# EAGLE board tfmsx (EAGLE 9.6.2), part 1 of 2
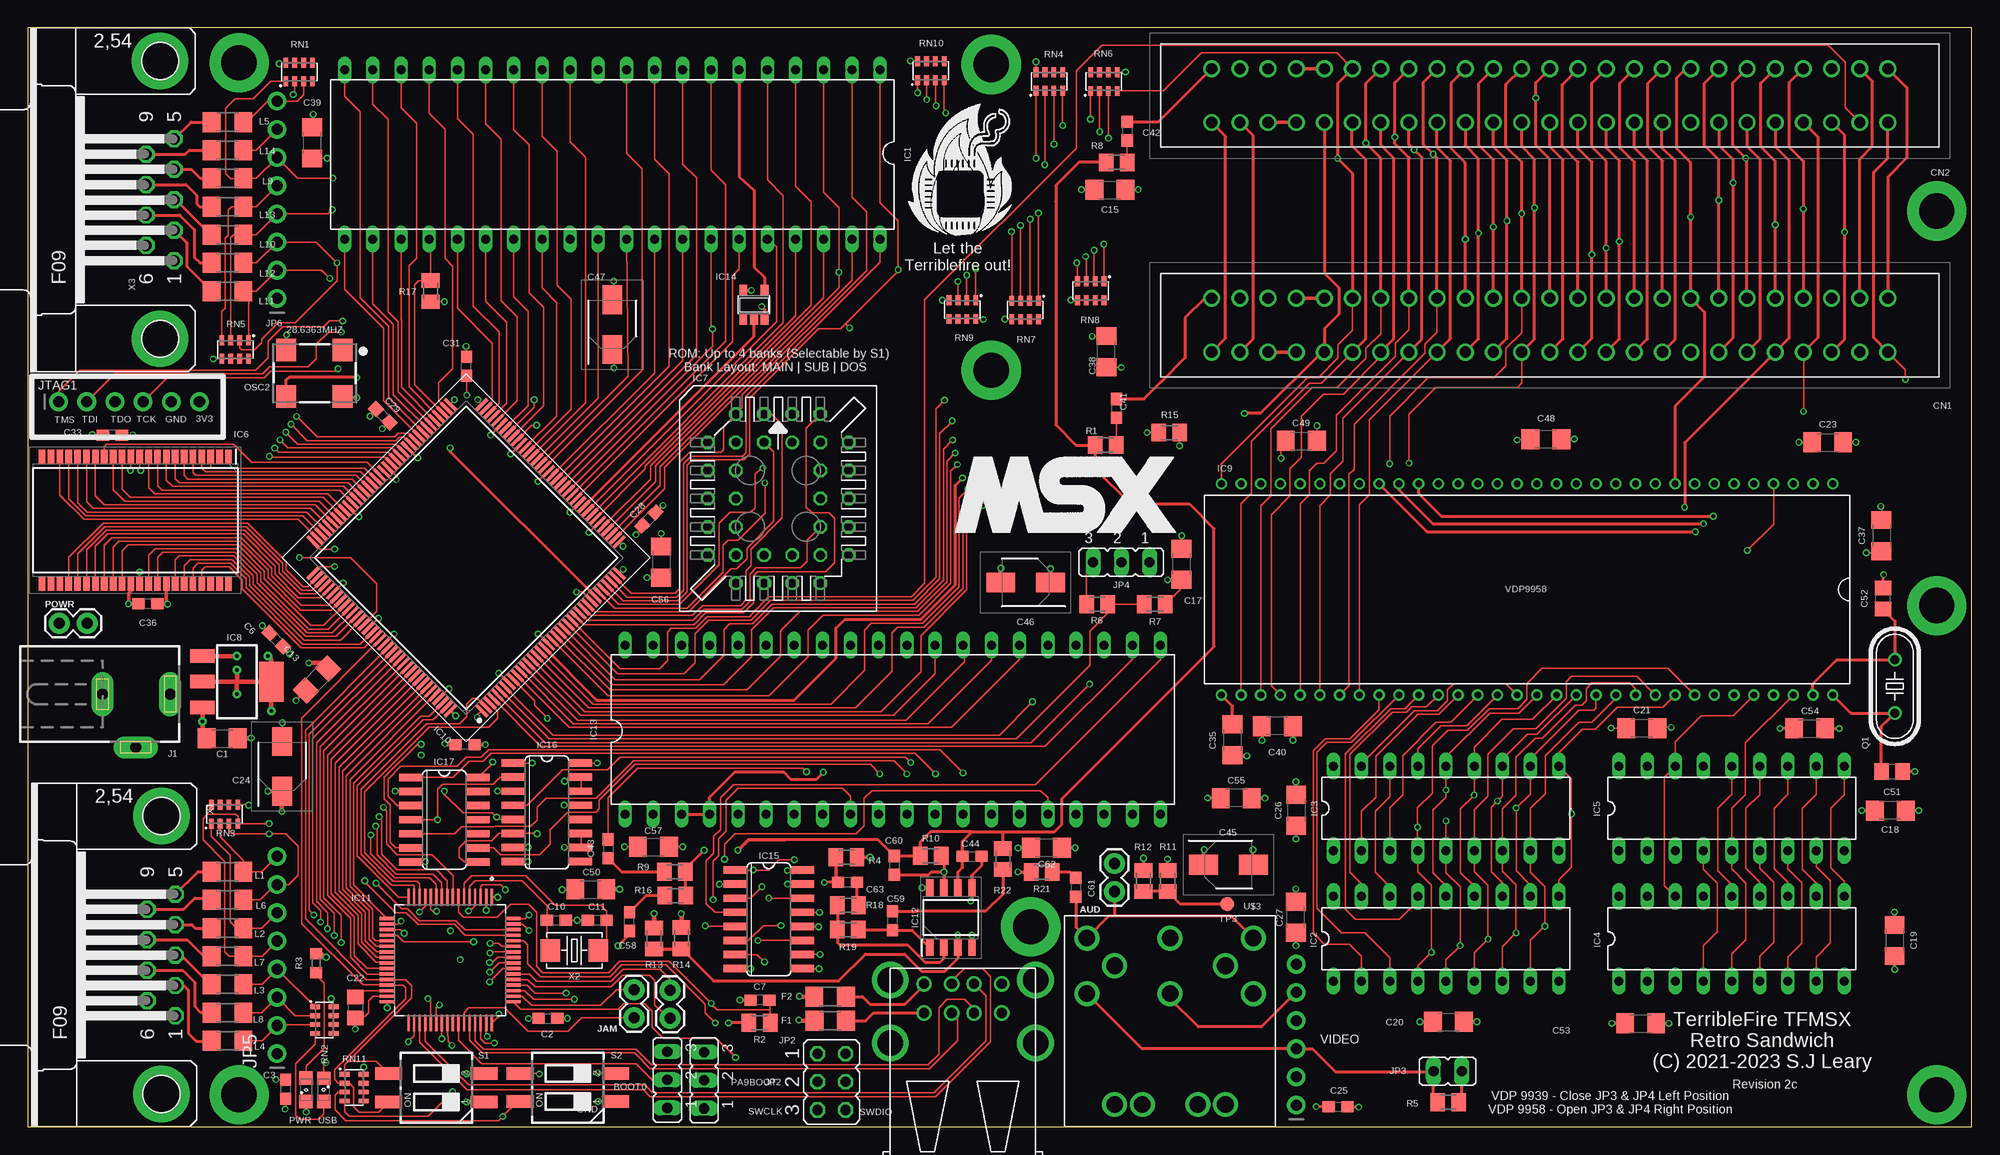
[diagram p3: board, top side]
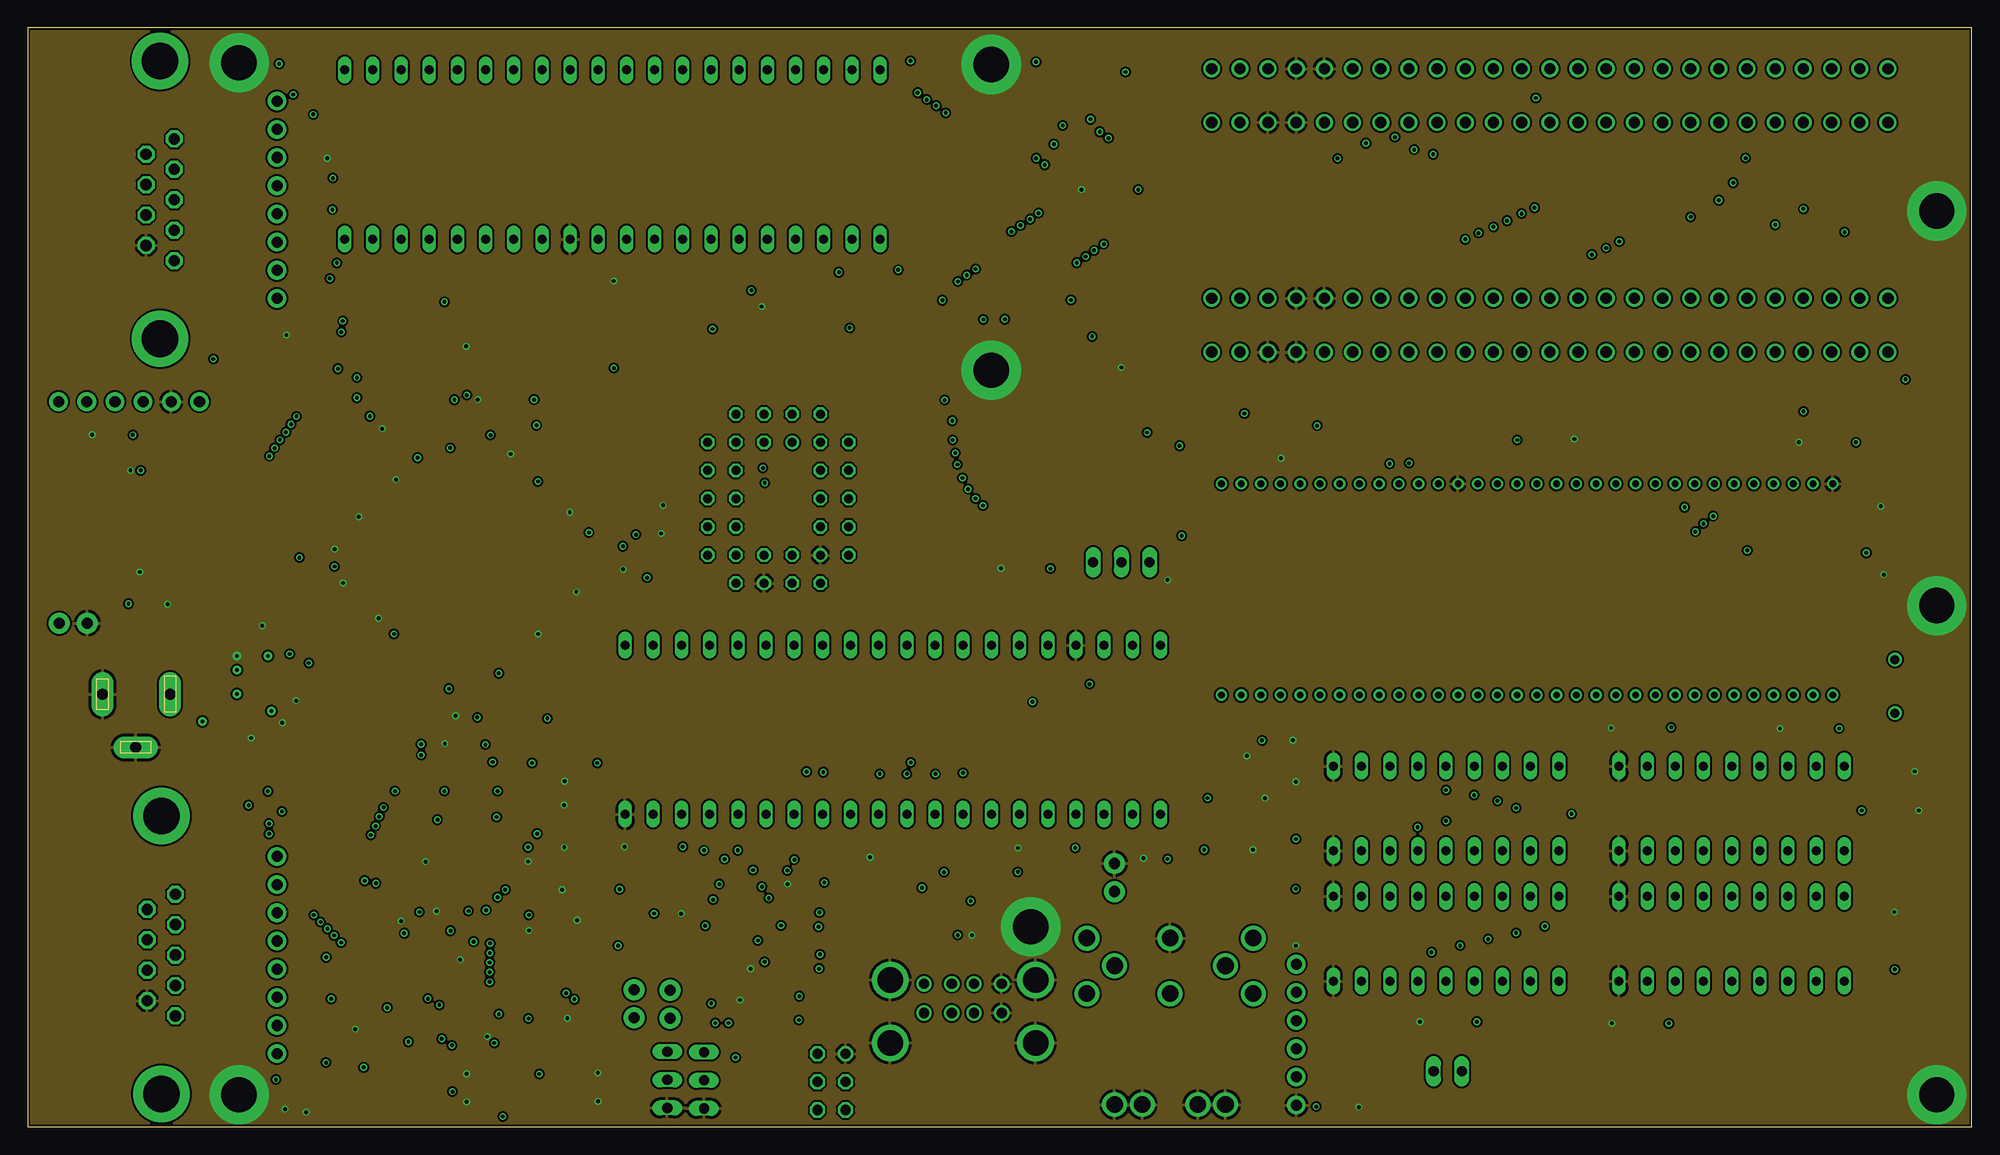
[diagram p4: board, inner layer GND]
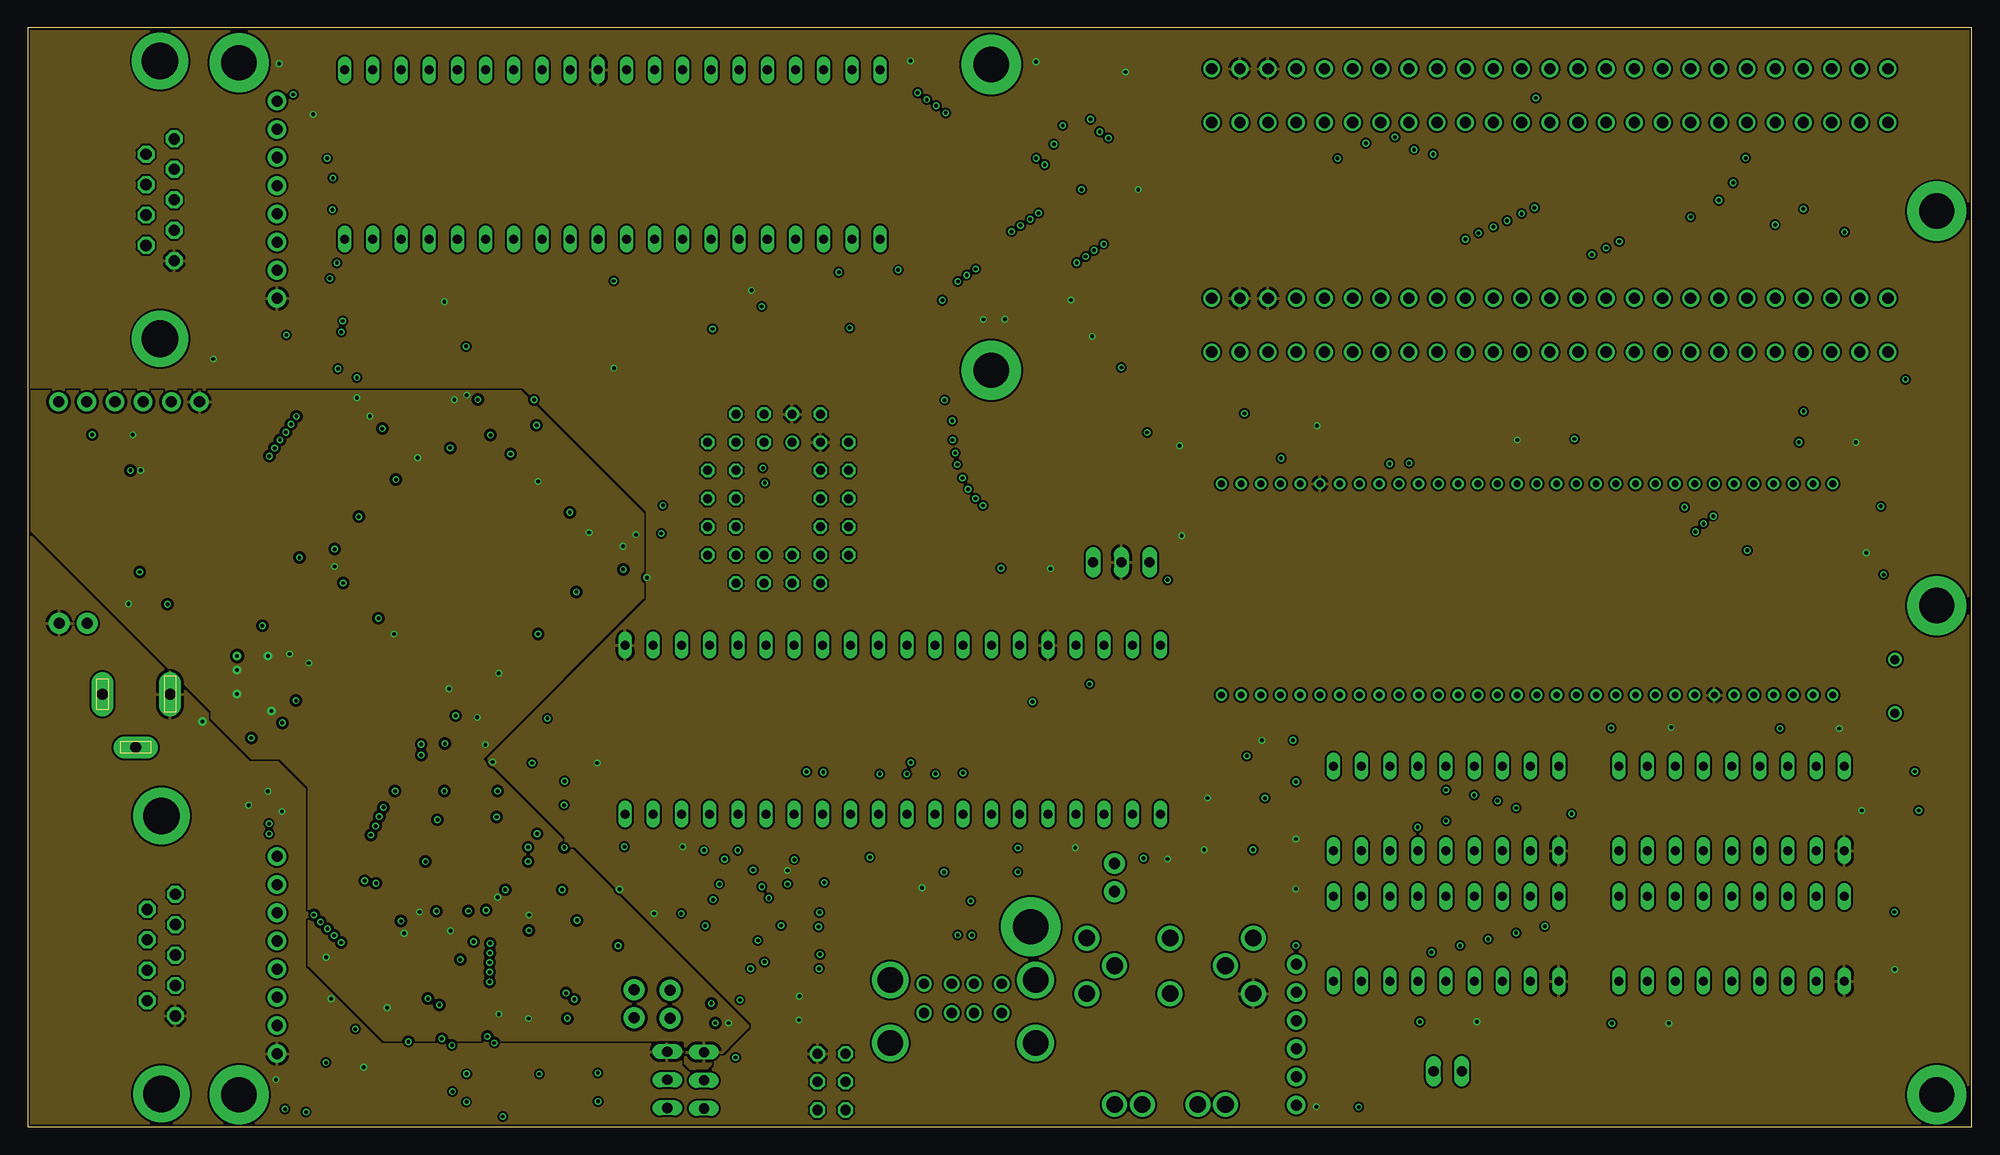
[diagram p5: board, inner layer PWR]
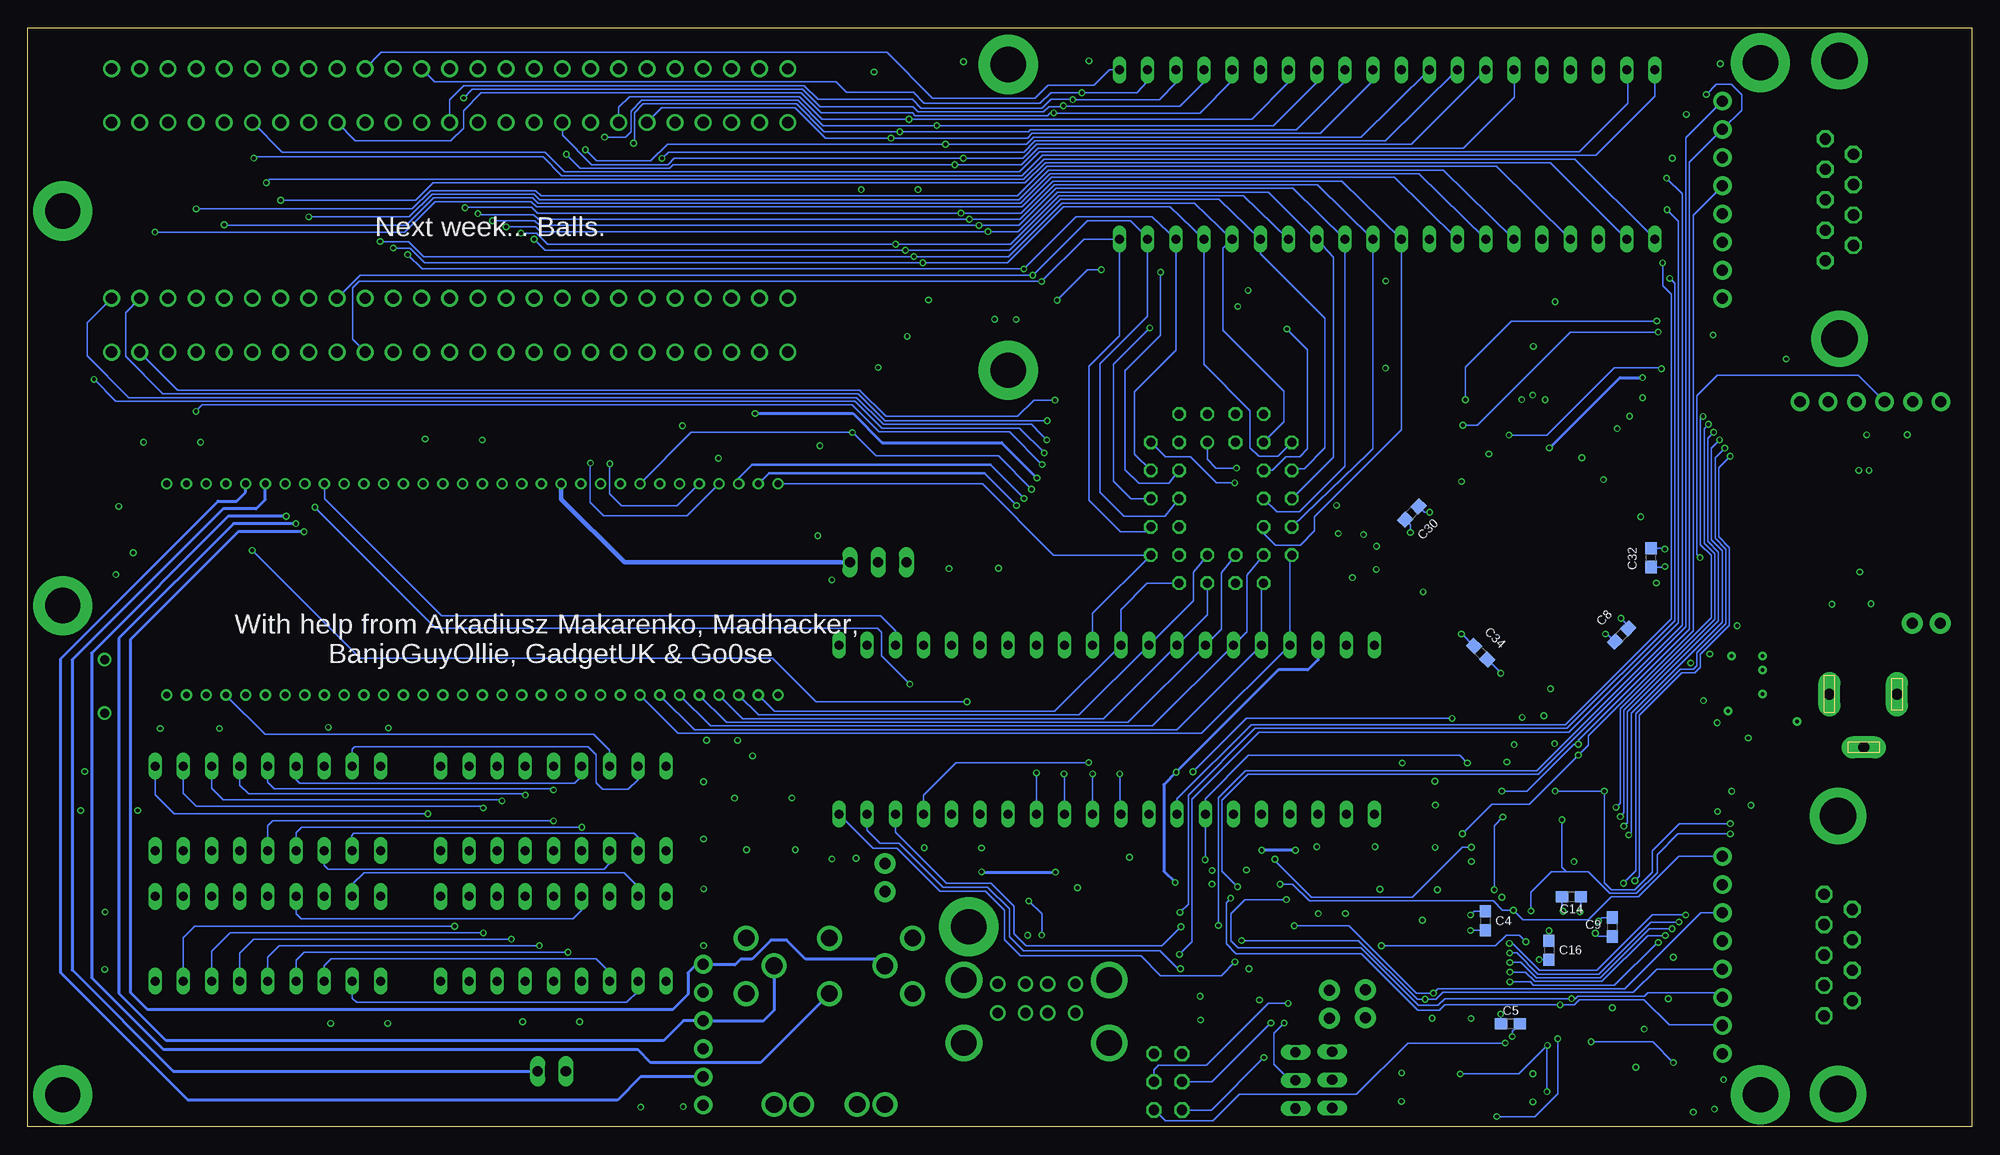
[diagram p6: board, bottom side, seen from below]

Size 175.26 x 99.07 mm. Coordinates in mm from the lower left corner, seen from the top.
Outline: 0,0 175.26,0 175.26,99.07 0,99.07 0,0
Copper layers (1*2*15*16): Top 0.035559375mm / dielectric 1.501140625mm / GND 0.035559375mm / dielectric 0.149859375mm / PWR 0.035559375mm / dielectric 0.200659375mm / Bottom 0.035559375mm
Design rules "jlcpcb-4layer": minimum track width 5mil, minimum drill 0.2mm, track to track 7mil, track to pad 8mil, pad to pad 7mil, via to via 10mil, smd to smd 0mil, copper to edge 0.2mm, drill to drill 10mil, minimum pad ring 3mil, minimum via ring 5mil, stop-mask expansion 3mil, vias tented up to drill 0.2mm, thermal gap 10mil
Net classes: 0 default: width 0.152 mm, drill 0.3 mm, clearance 0.152 mm

## Footprints (pad centres in the part's own frame; a part is rotated, then mirrored left to right if it is on the bottom)
1X02 = drill 1.016 pad 1.88: 1 0,0; 2 2.54,0
JP2 = drill 0.914 long: 1 -2.54,0; 2 0,0; 3 2.54,0
C1206 = smd 1.6 x 1.8: 1 -1.4,0; 2 1.4,0
C0603 = smd 1.1 x 1: 1 -0.85,0; 2 0.85,0
C0805 = smd 1.3 x 1.5: 1 -0.95,0; 2 0.95,0
CAPAE430X550N = smd 2.6 x 1.8: 1 -2.25,0; 2 2.25,0
55308435 = drill 1.016 pad 1.524: 1 0,0; 2 0,4.851; 3 2.54,0; 4 2.54,4.851; 5 5.08,0; 6 5.08,4.851; 7 7.62,0; 8 7.62,4.851; 9 10.16,0; 10 10.16,4.851; 11 12.7,0; 12 12.7,4.851; 13 15.24,0; 14 15.24,4.851; 15 17.78,0; 16 17.78,4.851; 17 20.32,0; 18 20.32,4.851; 19 22.86,0; 20 22.86,4.851; 21 25.4,0; 22 25.4,4.851; 23 27.94,0; 24 27.94,4.851; 25 30.48,0; 26 30.48,4.851; 27 33.02,0; 28 33.02,4.851; 29 35.56,0; 30 35.56,4.851; 31 38.1,0; 32 38.1,4.851; 33 40.64,0; 34 40.64,4.851; 35 43.18,0; 36 43.18,4.851; 37 45.72,0; 38 45.72,4.851; 39 48.26,0; 40 48.26,4.851; 41 50.8,0; 42 50.8,4.851; 43 53.34,0; 44 53.34,4.851; 45 55.88,0; 46 55.88,4.851; 47 58.42,0; 48 58.42,4.851; 49 60.96,0; 50 60.96,4.851
R1206 = smd 1.6 x 1.803: 1 -1.422,0; 2 1.422,0
DIL40 = drill 0.813 long: 1 -24.13,-7.62; 2 -21.59,-7.62; 3 -19.05,-7.62; 4 -16.51,-7.62; 5 -13.97,-7.62; 6 -11.43,-7.62; 7 -8.89,-7.62; 8 -6.35,-7.62; 9 -3.81,-7.62; 10 -1.27,-7.62; 11 1.27,-7.62; 12 3.81,-7.62; 13 6.35,-7.62; 14 8.89,-7.62; 15 11.43,-7.62; 16 13.97,-7.62; 17 16.51,-7.62; 18 19.05,-7.62; 19 21.59,-7.62; 20 24.13,-7.62; 21 24.13,7.62; 22 21.59,7.62; 23 19.05,7.62; 24 16.51,7.62; 25 13.97,7.62; 26 11.43,7.62; 27 8.89,7.62; 28 6.35,7.62; 29 3.81,7.62; 30 1.27,7.62; 31 -1.27,7.62; 32 -3.81,7.62; 33 -6.35,7.62; 34 -8.89,7.62; 35 -11.43,7.62; 36 -13.97,7.62; 37 -16.51,7.62; 38 -19.05,7.62; 39 -21.59,7.62; 40 -24.13,7.62
DIL18 = drill 0.813 long: 1 -10.16,-3.81; 2 -7.62,-3.81; 3 -5.08,-3.81; 4 -2.54,-3.81; 5 0,-3.81; 6 2.54,-3.81; 7 5.08,-3.81; 8 7.62,-3.81; 9 10.16,-3.81; 10 10.16,3.81; 11 7.62,3.81; 12 5.08,3.81; 13 2.54,3.81; 14 0,3.81; 15 -2.54,3.81; 16 -5.08,3.81; 17 -7.62,3.81; 18 -10.16,3.81
SOP80P1181X120-44N = smd 1.295 x 0.6: 1 -5.728,8.4; 2 -5.728,7.6; 3 -5.728,6.8; 4 -5.728,6; 5 -5.728,5.2; 6 -5.728,4.4; 7 -5.728,3.6; 8 -5.728,2.8; 9 -5.728,2; 10 -5.728,1.2; 11 -5.728,0.4; 12 -5.728,-0.4; 13 -5.728,-1.2; 14 -5.728,-2; 15 -5.728,-2.8; 16 -5.728,-3.6; 17 -5.728,-4.4; 18 -5.728,-5.2; 19 -5.728,-6; 20 -5.728,-6.8; 21 -5.728,-7.6; 22 -5.728,-8.4; 23 5.728,-8.4; 24 5.728,-7.6; 25 5.728,-6.8; 26 5.728,-6; 27 5.728,-5.2; 28 5.728,-4.4; 29 5.728,-3.6; 30 5.728,-2.8; 31 5.728,-2; 32 5.728,-1.2; 33 5.728,-0.4; 34 5.728,0.4; 35 5.728,1.2; 36 5.728,2; 37 5.728,2.8; 38 5.728,3.6; 39 5.728,4.4; 40 5.728,5.2; 41 5.728,6; 42 5.728,6.8; 43 5.728,7.6; 44 5.728,8.4
PLCC-S32 = drill 0.813: 1 1.27,5.08 | drill 0.813 octagon: 2 -1.27,7.62; 3 -1.27,5.08; 4 -3.81,7.62; 5 -6.35,5.08; 6 -3.81,5.08; 7 -6.35,2.54; 8 -3.81,2.54; 9 -6.35,0; 10 -3.81,0; 11 -6.35,-2.54; 12 -3.81,-2.54; 13 -6.35,-5.08; 14 -3.81,-7.62; 15 -3.81,-5.08; 16 -1.27,-7.62; 17 -1.27,-5.08; 18 1.27,-7.62; 19 1.27,-5.08; 20 3.81,-7.62; 21 6.35,-5.08; 22 3.81,-5.08; 23 6.35,-2.54; 24 3.81,-2.54; 25 6.35,0; 26 3.81,0; 27 6.35,2.54; 28 3.81,2.54; 29 6.35,5.08; 30 3.81,7.62; 31 3.81,5.08; 32 1.27,7.62
SOT223 = smd 1.219 x 2.235: 1 -2.311,-3.099; 2 0,-3.099; 3 2.311,-3.099 | smd 3.6 x 2.2: TAB 0,3.099
SOT274 = drill 0.61 pad 1.016: 1 -27.559,-9.525; 2 -25.781,-9.525; 3 -24.003,-9.525; 4 -22.225,-9.525; 5 -20.447,-9.525; 6 -18.669,-9.525; 7 -16.891,-9.525; 8 -15.113,-9.525; 9 -13.335,-9.525; 10 -11.557,-9.525; 11 -9.779,-9.525; 12 -8.001,-9.525; 13 -6.223,-9.525; 14 -4.445,-9.525; 15 -2.667,-9.525; 16 -0.889,-9.525; 17 0.889,-9.525; 18 2.667,-9.525; 19 4.445,-9.525; 20 6.223,-9.525; 21 8.001,-9.525; 22 9.779,-9.525; 23 11.557,-9.525; 24 13.335,-9.525; 25 15.113,-9.525; 26 16.891,-9.525; 27 18.669,-9.525; 28 20.447,-9.525; 29 22.225,-9.525; 30 24.003,-9.525; 31 25.781,-9.525; 32 27.559,-9.525; 33 27.559,9.525; 34 25.781,9.525; 35 24.003,9.525; 36 22.225,9.525; 37 20.447,9.525; 38 18.669,9.525; 39 16.891,9.525; 40 15.113,9.525; 41 13.335,9.525; 42 11.557,9.525; 43 9.779,9.525; 44 8.001,9.525; 45 6.223,9.525; 46 4.445,9.525; 47 2.667,9.525; 48 0.889,9.525; 49 -0.889,9.525; 50 -2.667,9.525; 51 -4.445,9.525; 52 -6.223,9.525; 53 -8.001,9.525; 54 -9.779,9.525; 55 -11.557,9.525; 56 -13.335,9.525; 57 -15.113,9.525; 58 -16.891,9.525; 59 -18.669,9.525; 60 -20.447,9.525; 61 -22.225,9.525; 62 -24.003,9.525; 63 -25.781,9.525; 64 -27.559,9.525
SAMACSYS_PARTS_QFP50P2200X2200X160-144N = smd 1.475 x 0.3: 1 -10.738,8.75; 2 -10.738,8.25; 3 -10.738,7.75; 4 -10.738,7.25; 5 -10.738,6.75; 6 -10.738,6.25; 7 -10.738,5.75; 8 -10.738,5.25; 9 -10.738,4.75; 10 -10.738,4.25; 11 -10.738,3.75; 12 -10.738,3.25; 13 -10.738,2.75; 14 -10.738,2.25; 15 -10.738,1.75; 16 -10.738,1.25; 17 -10.738,0.75; 18 -10.738,0.25; 19 -10.738,-0.25; 20 -10.738,-0.75; 21 -10.738,-1.25; 22 -10.738,-1.75; 23 -10.738,-2.25; 24 -10.738,-2.75; 25 -10.738,-3.25; 26 -10.738,-3.75; 27 -10.738,-4.25; 28 -10.738,-4.75; 29 -10.738,-5.25; 30 -10.738,-5.75; 31 -10.738,-6.25; 32 -10.738,-6.75; 33 -10.738,-7.25; 34 -10.738,-7.75; 35 -10.738,-8.25; 36 -10.738,-8.75; 73 10.738,-8.75; 74 10.738,-8.25; 75 10.738,-7.75; 76 10.738,-7.25; 77 10.738,-6.75; 78 10.738,-6.25; 79 10.738,-5.75; 80 10.738,-5.25; 81 10.738,-4.75; 82 10.738,-4.25; 83 10.738,-3.75; 84 10.738,-3.25; 85 10.738,-2.75; 86 10.738,-2.25; 87 10.738,-1.75; 88 10.738,-1.25; 89 10.738,-0.75; 90 10.738,-0.25; 91 10.738,0.25; 92 10.738,0.75; 93 10.738,1.25; 94 10.738,1.75; 95 10.738,2.25; 96 10.738,2.75; 97 10.738,3.25; 98 10.738,3.75; 99 10.738,4.25; 100 10.738,4.75; 101 10.738,5.25; 102 10.738,5.75; 103 10.738,6.25; 104 10.738,6.75; 105 10.738,7.25; 106 10.738,7.75; 107 10.738,8.25; 108 10.738,8.75 | smd 0.3 x 1.475: 37 -8.75,-10.738; 38 -8.25,-10.738; 39 -7.75,-10.738; 40 -7.25,-10.738; 41 -6.75,-10.738; 42 -6.25,-10.738; 43 -5.75,-10.738; 44 -5.25,-10.738; 45 -4.75,-10.738; 46 -4.25,-10.738; 47 -3.75,-10.738; 48 -3.25,-10.738; 49 -2.75,-10.738; 50 -2.25,-10.738; 51 -1.75,-10.738; 52 -1.25,-10.738; 53 -0.75,-10.738; 54 -0.25,-10.738; 55 0.25,-10.738; 56 0.75,-10.738; 57 1.25,-10.738; 58 1.75,-10.738; 59 2.25,-10.738; 60 2.75,-10.738; 61 3.25,-10.738; 62 3.75,-10.738; 63 4.25,-10.738; 64 4.75,-10.738; 65 5.25,-10.738; 66 5.75,-10.738; 67 6.25,-10.738; 68 6.75,-10.738; 69 7.25,-10.738; 70 7.75,-10.738; 71 8.25,-10.738; 72 8.75,-10.738; 109 8.75,10.738; 110 8.25,10.738; 111 7.75,10.738; 112 7.25,10.738; 113 6.75,10.738; 114 6.25,10.738; 115 5.75,10.738; 116 5.25,10.738; 117 4.75,10.738; 118 4.25,10.738; 119 3.75,10.738; 120 3.25,10.738; 121 2.75,10.738; 122 2.25,10.738; 123 1.75,10.738; 124 1.25,10.738; 125 0.75,10.738; 126 0.25,10.738; 127 -0.25,10.738; 128 -0.75,10.738; 129 -1.25,10.738; 130 -1.75,10.738; 131 -2.25,10.738; 132 -2.75,10.738; 133 -3.25,10.738; 134 -3.75,10.738; 135 -4.25,10.738; 136 -4.75,10.738; 137 -5.25,10.738; 138 -5.75,10.738; 139 -6.25,10.738; 140 -6.75,10.738; 141 -7.25,10.738; 142 -7.75,10.738; 143 -8.25,10.738; 144 -8.75,10.738
QFP50P1200X1200X160-64N = smd 1.47 x 0.28: 1 -5.67,3.75; 2 -5.67,3.25; 3 -5.67,2.75; 4 -5.67,2.25; 5 -5.67,1.75; 6 -5.67,1.25; 7 -5.67,0.75; 8 -5.67,0.25; 9 -5.67,-0.25; 10 -5.67,-0.75; 11 -5.67,-1.25; 12 -5.67,-1.75; 13 -5.67,-2.25; 14 -5.67,-2.75; 15 -5.67,-3.25; 16 -5.67,-3.75; 33 5.67,-3.75; 34 5.67,-3.25; 35 5.67,-2.75; 36 5.67,-2.25; 37 5.67,-1.75; 38 5.67,-1.25; 39 5.67,-0.75; 40 5.67,-0.25; 41 5.67,0.25; 42 5.67,0.75; 43 5.67,1.25; 44 5.67,1.75; 45 5.67,2.25; 46 5.67,2.75; 47 5.67,3.25; 48 5.67,3.75 | smd 0.28 x 1.47: 17 -3.75,-5.67; 18 -3.25,-5.67; 19 -2.75,-5.67; 20 -2.25,-5.67; 21 -1.75,-5.67; 22 -1.25,-5.67; 23 -0.75,-5.67; 24 -0.25,-5.67; 25 0.25,-5.67; 26 0.75,-5.67; 27 1.25,-5.67; 28 1.75,-5.67; 29 2.25,-5.67; 30 2.75,-5.67; 31 3.25,-5.67; 32 3.75,-5.67; 49 3.75,5.67; 50 3.25,5.67; 51 2.75,5.67; 52 2.25,5.67; 53 1.75,5.67; 54 1.25,5.67; 55 0.75,5.67; 56 0.25,5.67; 57 -0.25,5.67; 58 -0.75,5.67; 59 -1.25,5.67; 60 -1.75,5.67; 61 -2.25,5.67; 62 -2.75,5.67; 63 -3.25,5.67; 64 -3.75,5.67
SOIC127P600X175-8N = smd 1.5 x 0.65: 1 -2.7,1.905; 2 -2.7,0.635; 3 -2.7,-0.635; 4 -2.7,-1.905; 5 2.7,-1.905; 6 2.7,-0.635; 7 2.7,0.635; 8 2.7,1.905
SOT23-5 = smd 0.69 x 0.99: 1 -0.95,-1.29; 2 0,-1.29; 3 0.95,-1.29; 4 0.95,1.3; 5 -0.95,1.3
SO16 = smd 0.66 x 2.032: 1 -4.445,-3.073; 2 -3.175,-3.073; 3 -1.905,-3.073; 4 -0.635,-3.073; 5 0.635,-3.073; 6 1.905,-3.073; 7 3.175,-3.073; 8 4.445,-3.073; 9 4.445,3.073; 10 3.175,3.073; 11 1.905,3.073; 12 0.635,3.073; 13 -0.635,3.073; 14 -1.905,3.073; 15 -3.175,3.073; 16 -4.445,3.073
SO14 = smd 0.66 x 2.032: 1 -3.81,-3.073; 2 -2.54,-3.073; 3 -1.27,-3.073; 4 0,-3.073; 5 1.27,-3.073; 6 2.54,-3.073; 7 3.81,-3.073; 8 3.81,3.073; 9 2.54,3.073; 10 1.27,3.073; 11 0,3.073; 12 -1.27,3.073; 13 -2.54,3.073; 14 -3.81,3.073
DCJ0202 = drill 1 pad 2 long: 1 0,3.1; 2 4.8,0; 3 0,-3
JP3Q = drill 0.914 octagon: 1 -2.54,-1.27; 2 -2.54,1.27; 3 0,-1.27; 4 0,1.27; 5 2.54,-1.27; 6 2.54,1.27
JP1 = drill 0.914 long: 1 0,-1.27; 2 0,1.27
1X08_ROUND = drill 1 pad 1.676: 1 -8.89,0; 2 -6.35,0; 3 -3.81,0; 4 -1.27,0; 5 1.27,0; 6 3.81,0; 7 6.35,0; 8 8.89,0
1X06_ROUND = drill 1 pad 1.676: 1 -6.35,0; 2 -3.81,0; 3 -1.27,0; 4 1.27,0; 5 3.81,0; 6 6.35,0
OSC_7X5MM = smd 1.8 x 2: 1 -2.54,-2.1; 2 2.54,-2.1; 3 2.54,2.1; 4 -2.54,2.1
SML0805 = smd 1.2 x 1.2: A 1.05,0; C -1.05,0
HC49/S = drill 0.813: 1 -2.413,0; 2 2.413,0
M0805 = smd 1.3 x 1.6: 1 -0.95,0; 2 0.95,0
R0603 = smd 1 x 1.1: 1 -0.85,0; 2 0.85,0
RESCAXE80P320X160-8N = smd 0.9 x 0.425: 1 -0.85,1.2; 2 -0.85,0.4; 3 -0.85,-0.4; 4 -0.85,-1.2; 5 0.85,-1.2; 6 0.85,-0.4; 7 0.85,0.4; 8 0.85,1.2
CTS-219-02 = smd 1.13 x 2.44: 1 -1.27,-4.3; 2 1.27,-4.3; 3 1.27,4.3; 4 -1.27,4.3
B1,27 = smd 1.27 x 1.27: TP 0,0
838_DIN8 = drill 1.5: P$1 7.5,-5; P$2 0,-5; P$3 -7.5,-5; P$4 5,-2.5; P$5 -5,-2.5; P$6 7.5,0; P$7 -7.5,0; P$8 0,0; P$9 2.5,-15; P$10 -2.5,-15; P$11 -5,-15; P$12 5,-15
USB-A-2_USB_USB-A-2 = drill 0.92: 1-1 -3.5,-1.39; 1-2 -1,-1.39; 1-3 1,-1.39; 1-4 3.5,-1.39; 2-1 -3.5,-4.01; 2-2 -1,-4.01; 2-3 1,-4.01; 2-4 3.5,-4.01 | drill 2.3: SHIELD1 -6.55,-1.04; SHIELD2 -6.55,-6.72; SHIELD3 6.55,-6.72; SHIELD4 6.55,-1.04
F09HP = drill 1.016 octagon: 1 -5.486,-1.27; 2 -2.743,-1.27; 3 0,-1.27; 4 2.743,-1.27; 5 5.486,-1.27; 6 -4.115,1.27; 7 -1.372,1.27; 8 1.372,1.27; 9 4.115,1.27 | drill 3.302 pad 5.08: G1 -12.522,0; G2 12.522,0
X2-SMD-5.0X3.2X1.3MM = smd 1.778 x 2.032: 1 -2.159,0; 2 2.159,0

## Placement (x,y rotation side)
AUD  [1X02]  97.98,21.21 90 top
BOOT0  JP5  [JP2]  60.96,4.21 90 top
C1  100nF  [C1206]  17.53,35.03 0 top
C2  100nF  [C0603]  46.9,9.78 0 top
C3  10uF  [C0603]  23.24,3.4 270 top
C4  100n  [C0603]  43.86,18.59 270 bottom
C5  100n  [C0603]  41.59,9.32 0 bottom
C6  100n  [C0603]  22.4,43.91 135 top
C7  100n  [C0603]  66.01,11.44 180 top
C8  100n  [C0603]  31.57,44.34 45 bottom
C9  100n  [C0603]  32.39,18.03 90 bottom
C10  22p  [C0603]  47.66,18.63 0 top
C11  22p  [C0603]  51.34,18.62 180 top
C12  100n  [C0603]  39.43,34.46 180 top
C13  1uF  [C1206]  26.08,40.32 225 top
C14  100n  [C0603]  36.09,20.74 180 bottom
C15  47uF  [C1206]  97.56,84.47 0 top
C16  100nF  [C0603]  38.11,15.93 270 bottom
C17  10uF  [C1206]  104.02,50.72 90 top
C18  100nF  [C1206]  167.91,28.52 180 top
C19  100nF  [C1206]  168.3,16.81 270 top
C20  10uF  [C1206]  128.08,9.48 0 top
C21  100nF  [C1206]  145.51,35.94 0 top
C22  100n  [C0805]  29.53,10.77 270 top
C23  10uF  [C1206]  162.26,61.7 0 top
C24  47uF  [CAPAE430X550N]  22.95,32.49 90 top
C25  100n  [C0603]  118.13,1.82 0 top
C26  100nF  [C1206]  114.35,28.54 270 top
C27  100nF  [C1206]  114.33,18.9 90 top
C28  100nF  [C0603]  56,54.79 45 top
C29  100nF  [C0603]  32,64.11 315 top
C30  100n  [C0603]  50.48,55.34 45 bottom
C31  100nF  [C0603]  39.56,68.57 90 top
C32  100n  [C0603]  28.91,51.32 90 bottom
C33  100nF  [C0603]  7.64,62.36 180 top
C34  100n  [C0603]  44.28,42.74 135 bottom
C35  100nF  [C1206]  108.61,34.89 90 top
C36  100n  [C0603]  10.84,47.17 0 top
C37  10uF  [C1206]  167.12,53.3 270 top
C38  47uF  [C1206]  97.25,69.88 90 top
C39  100nF  [C1206]  25.65,88.7 90 top
C40  10uF  [C1206]  112.65,36.13 180 top
C41  4.7uF  [C0603]  98.14,64.76 270 top
C42  4.7uF  [C0603]  99.12,89.75 270 top
C43  4.7uF  [C0603]  52.33,25.07 270 top
C44  1nF  [C0603]  85.13,24.38 0 top
C45  22uF  [CAPAE430X550N]  108.24,23.65 0 top
C46  100uF  [CAPAE430X550N]  89.97,49.07 180 top
C47  22uF  [CAPAE430X550N]  52.7,72.32 90 top
C48  10uF  [C1206]  136.86,61.96 180 top
C49  10uF  [C1206]  114.81,61.83 0 top
C50  10uF  [C1206]  50.77,21.42 0 top
C51  33pF  [C0805]  168.07,32.05 0 top
C52  33pF  [C0805]  167.25,47.62 90 top
C53  10uF  [C1206]  145.4,9.33 0 top
C54  10uF  [C1206]  160.64,35.92 0 top
C55  10uF  [C1206]  108.95,29.65 180 top
C56  10uF  [C1206]  57.11,50.91 270 top
C57  100nF  [C1206]  56.41,25.25 0 top
C58  4.7uF  [C0603]  54.25,18.51 90 top
C59  4.7uF  [C0603]  77.97,18.59 90 top
C60  15nF  [C0603]  78.12,23.57 270 top
C61  4.7uF  [C0603]  94.48,21.6 270 top
C62  10uF  [C1206]  91.84,25.15 180 top
C63  4.7uF  [C0603]  73.91,22.07 0 top
CN1  5530843-5  [55308435]  167.7,74.69 180 top
CN2  5530843-5  [55308435]  167.7,95.39 180 top
F1  0R  [R1206]  72.35,9.57 0 top
F2  0R  [R1206]  72.34,11.76 0 top
IC1  Z80A  [DIL40]  52.7,87.65 180 top
IC2  41464  [DIL18]  127.87,16.97 0 top
IC3  41464  [DIL18]  127.87,28.72 0 top
IC4  41464  [DIL18]  153.61,16.97 0 top
IC5  41464  [DIL18]  153.61,28.72 0 top
IC6  AS7C4096A-12TCN  [SOP80P1181X120-44N]  9.7,54.68 270 top
IC7  AT27C020-55JUPLCCS32  [PLCC-S32]  67.65,56.63 0 top
IC8  LM1117MPX-3.3  [SOT223]  18.86,40.13 270 top
IC9  VDP9958  [SOT274]  135.17,48.46 180 top
IC10  XC95144XL  [SAMACSYS_PARTS_QFP50P2200X2200X160-144N]  39.52,51.31 135 top
IC11  STM32F722RET6  [QFP50P1200X1200X160-64N]  38.09,15.03 270 top
IC12  MCP6002T-I_SN  [SOIC127P600X175-8N]  83.22,18.87 90 top
IC13  YM2149  [DIL40]  77.99,35.81 0 top
IC14  SN74LVC1G17DBVR  [SOT23-5]  65.47,74.1 0 top
IC15  74LS157D  [SO16]  66.81,18.71 270 top
IC16  74LS157D  [SO16]  46.81,28.36 270 top
IC17  74LS07D  [SO14]  37.56,27.69 270 top
J1  DCJ0202  [DCJ0202]  9.74,39.01 270 top
JAM  [1X02]  54.67,12.38 270 top
JP2  [JP3Q]  72.46,4.06 270 top
JP3  [JP1]  128.02,5.02 90 top
JP4  [JP2]  98.59,50.9 180 top
JP5  [1X08_ROUND]  22.48,15.49 90 top
JP6  [1X08_ROUND]  22.48,83.57 90 top
JTAG1  JTAG  [1X06_ROUND]  9.13,65.37 0 top
L1  1uH  [R1206]  18.01,23.01 180 top
L2  1uH  [R1206]  18.01,17.93 180 top
L3  1uH  [R1206]  18.01,12.85 180 top
L4  1uH  [R1206]  18.01,7.77 180 top
L5  1uH  [R1206]  18.01,90.58 180 top
L6  1uH  [R1206]  18.01,20.47 0 top
L7  1uH  [R1206]  18.01,15.39 0 top
L8  1uH  [R1206]  18.01,10.31 0 top
L9  1uH  [R1206]  18.01,85.5 180 top
L10  1uH  [R1206]  18.01,80.42 180 top
L11  1uH  [R1206]  18.01,75.34 180 top
L12  1uH  [R1206]  18.01,77.88 0 top
L13  1uH  [R1206]  18.01,82.96 0 top
L14  1uH  [R1206]  18.01,88.04 0 top
OSC2  28.6363MHZ  [OSC_7X5MM]  25.86,67.93 180 top
PA9BOOT  PABOOT  [JP2]  57.66,4.25 90 top
POWR  [1X02]  2.83,45.41 0 top
PWR  LED  [SML0805]  25.09,3.35 90 top
Q1  21.47727MHZ  [HC49/S]  168.32,39.72 90 top
R1  4.7K  [M0805]  97.19,61.46 0 top
R2  100K  [M0805]  65.98,9.38 180 top
R3  10k  [R0603]  25.99,14.76 270 top
R4  1K  [M0805]  73.82,24.3 180 top
R5  390  [M0805]  128.06,2.22 0 top
R6  5K  [M0805]  96.41,47.12 180 top
R7  10K  [M0805]  101.61,47.12 180 top
R8  4.7K  [M0805]  98.18,86.93 0 top
R9  4.7K  [M0805]  58.33,23 180 top
R10  4.7K  [M0805]  81.41,24.44 180 top
R11  1K  [M0805]  102.77,22.17 90 top
R12  10K  [M0805]  100.59,22.17 270 top
R13  5.6K  [M0805]  56.47,16.99 270 top
R14  5.6K  [M0805]  58.93,17.01 90 top
R15  10K  [M0805]  102.9,62.59 0 top
R16  4.7K  [M0805]  58.39,20.86 180 top
R17  4.7K  [M0805]  36.32,75.33 270 top
R18  1K  [M0805]  73.95,19.99 0 top
R19  4.7K  [M0805]  73.94,17.79 180 top
R21  220  [M0805]  91.42,22.97 180 top
R22  10K  [M0805]  87.91,24.15 270 top
RN1  CAY16-103J4LF  [RESCAXE80P320X160-8N]  24.47,95.09 90 top
RN2  CAY16-103J4LF  [RESCAXE80P320X160-8N]  26.75,9.63 0 top
RN3  CAY16-103J4LF  [RESCAXE80P320X160-8N]  17.75,28.18 90 top
RN4  CAY16-103J4LF  [RESCAXE80P320X160-8N]  92.1,94.23 90 top
RN5  CAY16-103J4LF  [RESCAXE80P320X160-8N]  18.7,70.07 270 top
RN6  CAY16-103J4LF  [RESCAXE80P320X160-8N]  97.02,94.22 90 top
RN7  CAY16-103J4LF  [RESCAXE80P320X160-8N]  89.92,73.63 270 top
RN8  CAY16-103J4LF  [RESCAXE80P320X160-8N]  95.83,75.38 270 top
RN9  CAY16-103J4LF  [RESCAXE80P320X160-8N]  84.26,73.67 270 top
RN10  CAY16-103J4LF  [RESCAXE80P320X160-8N]  81.42,95.2 90 top
RN11  CAY16-103J4LF  [RESCAXE80P320X160-8N]  29.42,3.55 0 top
S1  219-02  [CTS-219-02]  36.85,3.53 90 top
S2  219-02  [CTS-219-02]  48.71,3.55 90 top
TP3  TPB1,27  [B1,27]  108.14,20.08 0 top
U$3  DIN45326  [838_DIN8]  102.98,17.02 0 top
U$5  USB-A-2_USB_USB-A-2  [USB-A-2_USB_USB-A-2]  84.3,14.29 0 top
UART  [1X02]  57.91,12.33 270 top
USB  LED  [SML0805]  26.69,3.34 270 top
VIDEO  VIDEO  [1X06_ROUND]  114.37,8.32 90 top
X1  DB9  [F09HP]  12.05,15.49 90 top
X2  SMD-CRYSTAL-25MHZ-20PF-20PPM(2P-5.0X3.2MM)  [X2-SMD-5.0X3.2X1.3MM]  49.27,15.91 180 top
X3  DB9  [F09HP]  11.94,83.57 90 top

## Tracks (layer width: path | path; a pad name or v marks a point on that pad's centre or on a via)
!BACK1  (via drill 0.35)
  Top 0.152: IC15.5 61.13,18.08 v61.07,18.14 | v48.53,12.07 45.74,12.07 45.02,12.78 IC11.52 | RN3.1 16.55,26.21 18.27,24.49 18.27,18.48 18.81,17.94 18.81,17.86 19.63,17.86 19.7,17.93 L2.1 21.11,17.93 JP5.6
  Bottom 0.152: v61.07,18.14 56.14,18.14 50.07,12.07 v48.53,12.07 48.14,12.46 31.27,12.46 24.43,19.3 JP5.6
!BACK1_B
  Top 0.254: L2.2 15.09,17.93 14.79,18.24 X1.4
!BACK2  (via drill 0.35)
  Top 0.152: IC15.6 64.99,16.81 66.34,18.16 v67.92,18.16 | RN1.1 21.92,94.24 20.34,92.66 18.69,92.66 17.83,91.8 17.83,85.92 18.27,85.48 19.42,85.48 L9.1 20.6,85.5 JP6.6 24.33,85.52 v27.52,85.52
  Bottom 0.152: v67.92,18.16 67.92,29.69 65.5,32.11 39.22,32.11 26.11,45.22 26.11,84.12 v27.52,85.52
!EXCS1  (via drill 0.35)
  Top 0.152: IC10.21 52.72,39.87 62.75,39.87 65.27,42.39 65.27,44.82 67.25,46.8 80.08,46.8 82.55,49.27 82.55,61.08 v83.39,61.92
  Top 0.254: CN2.1 169.42,93.67 169.42,87.34 167.7,85.62 CN1.1
  Bottom 0.152: CN1.1 169.9,72.49 169.9,69.49 166.15,65.74 100.54,65.74 98.11,63.32 84.78,63.32 83.86,62.4 v83.39,61.92
!EXCS2  (via drill 0.35)
  Top 0.152: IC10.20 52.5,39.39 64.84,39.39 67.88,42.42 67.88,44.71 69.64,46.47 80.22,46.47 82.88,49.13 82.88,60.01 v83.62,60.75 | CN1.2 169.28,68.26 v169.28,67.38
  Top 0.254: CN1.2 166.43,71.11 166.43,86.05 167.7,87.32 CN2.2
  Bottom 0.152: v169.28,67.38 167.32,65.41 100.67,65.41 98.25,62.99 85.86,62.99 v83.62,60.75
!EXCS12  (via drill 0.35)
  Top 0.152: IC10.22 52.97,40.33 60.59,40.33 62.78,42.52 62.78,44.84 63.29,45.34 65.33,45.34 67.11,47.13 79.94,47.13 82.22,49.41 82.22,62.47 83.35,63.6 v83.35,63.64 v83.35,63.65
  Top 0.254: CN2.3 166.3,94.25 166.3,88.37 165.16,87.23 CN1.3
  Bottom 0.152: CN1.3 166.45,73.41 166.45,69.44 163.07,66.07 100.4,66.07 97.98,63.65 v83.35,63.65
!EXSLTSL1  (via drill 0.35)
  Top 0.152: IC10.23 53.16,40.84 59.16,40.84 60.17,41.86 60.17,44.45 61.4,45.68 65.19,45.68 66.97,47.46 79.81,47.46 81.89,49.55 81.89,64.74 v82.66,65.51
  Bottom 0.152: CN1.4 161.72,66.4 100.26,66.4 97.9,64.04 86.02,64.04 84.55,65.51 v82.66,65.51
!EXSLTSL2
  Top 0.152: IC10.24 53.42,41.3 56.97,41.3 57.69,42.01 57.69,44.6 58.01,44.93 60.19,44.93 61.26,46.01 65.05,46.01 65.39,46.34 65.39,46.37 66.81,47.79 79.67,47.79 80.86,48.99 80.86,74.55 94.54,88.22 94.54,95.2 96.86,97.52 162.32,97.52 163.85,95.98 163.85,91.84 CN2.4
!FWD1  (via drill 0.35)
  Top 0.152: IC15.2 v62.36,21.89 v62.36,21.88 | IC11.2 v41.34,19.55 v41.33,19.54 | RN3.2 17.35,26.14 19.44,24.05 L1.1 21.11,23.02 JP5.8
  Bottom 0.152: v62.36,21.88 61.23,21.88 59.73,20.38 43.14,20.38 42.3,19.54 v41.33,19.54 40.47,18.68 34.57,18.68 32.51,20.73 30.04,20.73 26.39,24.38 JP5.8
!FWD1_B
  Top 0.254: X1.5 15.35,23.01 L1.2
!FWD2  (via drill 0.35)
  Top 0.152: v66.19,21.65 65.16,20.62 IC15.3 | RN1.3 24.87,93.06 24.27,92.46 JP6.8 21.63,92.46 19.75,90.58 L5.1
  Bottom 0.152: v66.19,21.65 67.59,23.05 67.59,29.45 65.25,31.78 39.08,31.78 25.78,45.08 25.78,89.15 JP6.8
!INT
  Top 0.152: IC10.70 42.48,65.23 42.48,71.66 40.16,73.98 40.16,89.47 38.73,90.89 IC1.16
!LEFT1  (via drill 0.35)
  Top 0.152: IC15.11 v65.84,16.81 v65.83,16.8 | L3.1 19.47,12.88 21.14,12.88 JP5.4 22.5,14.22 RN2.1 | IC11.51 44.81,12.28 45.59,11.51 v49.28,11.51
  Bottom 0.152: v65.83,16.8 55.27,16.8 49.98,11.51 v49.28,11.51 48.3,11.51 47.69,12.13 30.49,12.13 28.39,14.22 JP5.4
!LEFT1_B
  Top 0.254: L3.2 16.46,12.85 13.82,15.49 X1.3
!LEFT2  (via drill 0.35)
  Top 0.152: v71.43,15.56 69.9,15.56 IC15.10 | RN5.3 18.3,73.55 18.29,73.54 18.29,80.14 18.57,80.42 L10.1 20.6,80.42 JP6.4 27.09,82.3 v27.47,82.68
  Bottom 0.152: v71.43,15.56 70.3,16.69 70.3,29.53 64.25,35.59 36.31,35.59 26.44,45.45 26.44,81.65 v27.47,82.68
!M1  (via drill 0.35)
  Top 0.152: IC10.66 45.1,65.02 45.1,73.54 43.81,74.82 IC1.27
  Top 0.254: CN2.9 156.23,94.08 156.23,88.36 157.54,87.05 v157.54,81.31 CN1.9
  Bottom 0.152: IC1.27 49.84,85.91 83.11,85.91 85.77,83.25 129.26,83.25 129.74,83.74 138.67,83.74 141.14,81.26 157.49,81.26 v157.54,81.31
!OUT1  (via drill 0.35)
  Top 0.152: v61.78,20.49 61.78,23.93 62.29,24.44 62.29,25.96 62.97,26.64 62.97,29.43 64.05,30.51 73.47,30.51 74.18,29.8 IC13.9 | L8.2 21.11,10.31 JP5.3 24.11,10.03 RN2.2 | IC11.37 36.34,11.31 v36.07,11.57
  Bottom 0.152: v61.78,20.49 65.52,20.49 66.81,19.2 66.81,16.8 66.14,16.14 55.07,16.14 49.89,10.95 48.14,10.95 47.52,11.58 v36.08,11.58 v36.07,11.57 35.72,11.57 35.49,11.8 29.51,11.8 29.19,12.11 22.91,12.11 JP5.3
!OUT2  (via drill 0.35)
  Top 0.152: RN5.2 19.11,70.24 19.29,70.05 20.47,70.05 21.1,70.68 21.1,71 22.6,72.5 24.12,72.5 27.91,76.29 27.91,77.83 v27.87,77.88 25.99,79.76 JP6.3 20.6,77.88 L12.2
  Bottom 0.152: IC13.8 71.64,29.57 64.95,36.26 36.66,36.26 27.1,45.82 27.1,75.06 27.87,75.83 v27.87,77.88
!P1_TRG1  (via drill 0.35)
  Top 0.152: IC16.2 42.6,31.53 41.96,30.89 37.4,30.89 36.94,30.43 v36.94,27.69 IC17.4 | RN3.3 18.15,26.71 18.44,26.42 v21.76,26.42 23.26,26.42 24.38,25.29 24.38,22.68 23.53,21.82 JP5.7 22.32,21.82 20.98,20.47 L6.2 | v39.73,19.47 39.95,19.69 40.07,19.69 40.34,19.95 IC11.4
  Bottom 0.152: 36.54,22.99 36.94,23.39 v36.94,27.69 | 36.54,22.99 34.57,22.99 32.64,21.06 30.22,21.06 28.36,22.92 28.36,24.54 26.49,26.42 v21.76,26.42 | v39.73,19.47 39.73,21.17 37.92,22.99 36.54,22.99
!P1_TRG2  (via drill 0.35)
  Top 0.152: IC17.2 33.15,30.23 v33.12,30.27 | IC11.3 40.84,21.66 41.02,21.84 42.65,21.84 43.05,21.44 v43.05,21.39 | IC16.5 42.48,27.72 v42.27,27.94 41.89,28.32 39.25,28.32 37.56,30.01 v37.56,30.27 | v21.76,27.34 21.75,27.33 RN3.4 18.95,27.99 18.75,28.19 16.19,28.19 15.8,27.8 15.8,25.9 17.78,23.93 17.78,15.8 18.18,15.39 L7.2 21.13,15.39 22.48,16.74 JP5.5
  Bottom 0.152: v37.56,30.27 v33.12,30.27 33.12,22.02 32.49,21.39 30.38,21.39 28.79,22.97 28.79,24.91 26.36,27.34 v21.76,27.34 | v42.27,27.94 43.05,27.16 v43.05,21.39
!P2_TRG1  (via drill 0.35)
  Top 0.152: IC16.3 v42.37,30.26 v42.36,30.27 | v35.47,34.49 35.14,34.49 32.14,31.5 32.14,29.57 32.68,29.03 32.68,25.64 33.17,25.15 IC17.6 | L14.2 20.6,88.04 JP6.7 | v23.94,93.06 24.07,93.19 RN1.2
  Bottom 0.152: v42.36,30.27 40.09,30.27 35.87,34.49 v35.47,34.49 35.47,34.85 25.45,44.87 25.45,86.94 JP6.7 20.75,91.65 20.75,93.03 21.68,93.97 23.03,93.97 v23.94,93.06
!P2_TRG2  (via drill 0.35)
  Top 0.152: v45.92,26.43 45.89,26.45 IC16.6 42.5,26.45 41.83,25.78 39.52,25.78 38.89,25.15 38.89,24.31 39.33,23.88 IC17.8 | RN5.4 17.5,73.5 17.79,73.79 17.79,80.1 18.05,80.37 18.05,82.63 18.38,82.96 L13.2 20.6,82.96 JP6.5
  Bottom 0.152: v45.92,26.43 45.92,26.45 43.26,29.1 39.89,29.1 v35.48,33.52 34.58,34.41 34.58,35.27 25.12,44.73 25.12,82.16 22.48,84.8 JP6.5
!RESET  (via drill 0.35)
  Top 0.152: IC10.69 43.18,65.23 43.18,72.52 41.27,74.43 IC1.26
  Top 0.254: CN2.15 150.05,95.52 150.05,95.96 148.66,94.56 148.66,88.18 149.92,86.92 v149.92,82.02 CN1.15 151.17,73.44 151.17,67.62 148.5,64.95 IC9.9
  Bottom 0.152: IC1.26 47.63,86.24 83.25,86.24 85.91,83.58 129.12,83.58 129.6,84.07 138.81,84.07 140.85,82.02 v149.92,82.02 | IC9.9 148.5,56.64 137.95,46.09 98.37,46.09 97.01,44.73 97.01,43.51 97.06,43.46 IC13.23
!RFSH  (via drill 0.35)
  Top 0.152: IC10.61 47.69,64.08 47.69,74.28 46.35,75.62 IC1.28
  Top 0.254: CN1.6 163.79,71.01 v163.79,80.66 163.79,89.37 CN2.6
  Bottom 0.152: IC1.28 52.05,85.58 82.98,85.58 85.63,82.92 129.4,82.92 129.88,83.41 138.53,83.41 141.28,80.66 v163.79,80.66
!RIGHT1  (via drill 0.35)
  Top 0.152: IC15.14 v66.81,20.62 | L4.1 21.13,7.77 JP5.2 22.59,9.23 RN2.3 | IC11.38 36.84,10.73 v37.11,11.01
  Bottom 0.152: v66.81,20.62 67.21,20.23 67.21,16.49 66.32,15.6 55.01,15.6 49.92,10.52 48.01,10.52 47.52,11.01 v37.11,11.01 35.81,11.01 35.35,11.47 29.54,11.47 27.27,9.2 22.53,9.2 JP5.2
!RIGHT1_B
  Top 0.254: L4.2 16.55,7.73 15.21,7.73 14.48,8.46 14.48,12.32 14.05,12.75 X1.2
!RIGHT2  (via drill 0.35)
  Top 0.152: IC15.13 71.37,19.35 v71.39,19.34 | v27.23,76.48 26.5,77.22 JP6.2 20.6,75.34 L11.1 19.91,74.87 RN5.1
  Bottom 0.152: v71.39,19.34 70.63,20.09 70.63,29.89 64.61,35.92 36.5,35.92 26.77,45.64 26.77,76.02 v27.23,76.48
!RW_VRAM  (via drill 0.35)
  Top 0.152: IC9.57 147.88,41.33 136.51,41.33 135.14,39.96 135.14,38.53 134.32,37.71 131.75,37.71 129.8,35.75 128.02,35.75 126.61,34.34 126.61,30.07 125.3,28.75 v125.3,27.01 125.3,24.93 IC3.4 125.33,23.02 126.55,21.79 v126.55,15.74 125.33,14.51 IC2.4 | IC5.4 151.07,23.24 152.33,21.98 152.33,17.6 151.07,16.34 IC4.4
  Bottom 0.152: IC5.4 151.07,26.52 150.59,27.01 v125.3,27.01 | IC4.4 151.07,15.02 150.35,15.74 v126.55,15.74
!SCE
  Top 0.152: IC6.8 12.5,58.3 13.06,57.74 28.49,57.74 IC10.97
!SLOT_INT  (via drill 0.35)
  Top 0.152: IC10.19 52.32,38.86 66.82,38.86 70.35,42.39 70.35,44.78 71.71,46.14 80.35,46.14 83.21,49 83.21,59.11 v83.81,59.71 | v160.1,64.5 160.1,69.83 CN1.8
  Top 0.254: CN2.8 161.36,89.26 161.36,71.12 CN1.8
  Bottom 0.152: v160.1,64.5 159.51,65.08 100.93,65.08 98.51,62.66 86.76,62.66 v83.81,59.71
!VDP_INT  (via drill 0.35)
  Top 0.152: v84.78,57.49 83.97,56.68 83.97,48.68 80.67,45.38 76.05,45.38 75.45,44.78 75.45,41.15 72.41,38.1 50.96,38.1 IC10.16 | R15.1 v100.92,62.59
  Bottom 0.152: IC9.25 115.44,62.59 v100.92,62.59 98.8,60.48 87.76,60.48 v84.78,57.49
!VDPR  (via drill 0.35)
  Top 0.152: v86.11,56.02 84.63,54.54 84.63,48.41 80.52,44.29 80.52,41.05 76.91,37.44 50.2,37.44 IC10.14
  Bottom 0.203: v86.11,56.02 89.02,58.92 108.44,58.92 IC9.31
!VDPW  (via drill 0.35)
  Top 0.152: v85.45,56.64 84.3,55.5 84.3,48.55 80.81,45.05 78.42,45.05 77.92,44.55 77.92,41.07 74.63,37.77 50.58,37.77 IC10.15
  Bottom 0.203: v85.45,56.64 88.47,59.67 109.95,59.67 111.17,58.46 IC9.30
!VRESET  (via drill 0.35)
  Top 0.152: IC10.7 47.38,35.31 87.59,35.31 v90.59,38.32 | v155.03,51.97 157.39,54.34 IC9.4
  Bottom 0.152: v90.59,38.32 104.19,38.32 108.1,42.23 145.28,42.23 v155.03,51.97
A0  (via drill 0.35)
  Top 0.152: 134.94,70.11 134.71,69.87 134.71,67.08 134.28,66.64 126.91,66.64 124.53,64.26 v124.53,59.83 | v91.13,82.37 91.13,74.5 RN7.1 | IC1.30 51.44,65.7 IC10.58
  Top 0.254: CN1.28 134.94,70.11 135.84,71 v135.84,82.85 135.84,87.21 134.68,88.37 CN2.28
  Bottom 0.152: v135.84,82.85 135.81,82.88 129.82,82.88 129.31,82.37 v91.13,82.37 85.72,82.37 82.84,85.25 56.8,85.25 IC1.30 51.44,62.85 59.27,55.01 59.27,53.72 60.54,52.45 62.76,52.45 63.84,53.53 IC7.12 | IC9.29 115.83,55.09 123.35,55.09 124.55,56.29 124.55,59.81 v124.53,59.83
A1  (via drill 0.35)
  Top 0.152: IC10.57 54.12,67.67 IC1.31 | CN1.27 134.68,71.58 133.28,70.17 133.28,68.6 132.19,67.52 126.24,67.52 122.78,64.06 v122.78,59.77 | v90.37,81.81 90.37,74.54 RN7.2
  Top 0.254: CN1.27 v134.68,82.32 134.68,86.94 133.27,88.35 133.27,93.98 CN2.27
  Bottom 0.152: v134.68,82.32 134.59,82.24 129.64,82.24 129.22,81.81 v90.37,81.81 85.81,81.81 82.7,84.92 59.01,84.92 IC1.31 53.98,61.12 54.38,60.71 IC7.11 | IC9.28 116.72,55.98 121.7,55.98 122.78,57.06 v122.78,59.77
A2  (via drill 0.35)
  Top 0.152: RN7.3 89.52,81.24 v89.5,81.26 | IC1.32 56.52,67.95 IC10.54
  Top 0.254: CN1.30 133.37,71.07 v133.37,81.68 133.37,87.13 132.14,88.36 CN2.30
  Bottom 0.152: v133.37,81.68 v133.36,81.68 129.55,81.68 129.13,81.26 v89.5,81.26 85.89,81.26 82.56,84.59 61.22,84.59 IC1.32 56.52,79.85 56.52,59.54 60.63,55.43 62.64,55.43 IC7.10
A3  (via drill 0.35)
  Top 0.152: RN7.4 88.72,80.68 v88.69,80.7 | IC1.33 59.05,69.08 IC10.52
  Top 0.254: CN2.29 130.79,94.04 130.79,88.53 132.14,87.18 v132.14,81.12 CN1.29
  Bottom 0.152: v132.14,81.12 129.46,81.12 129.04,80.7 v88.69,80.7 85.98,80.7 82.42,84.26 63.43,84.26 59.26,80.09 IC1.33 57.56,78.39 57.56,60.37 IC7.9
A4  (via drill 0.35)
  Top 0.152: IC10.50 61.73,70.34 v61.73,71.92 61.59,72.06 IC1.34 | v97.01,79.57 97.03,79.55 RN8.1
  Top 0.254: CN1.32 130.8,71.04 v130.8,80.56 130.8,87.26 129.6,88.46 CN2.32
  Bottom 0.152: IC1.34 65.64,83.93 82.28,83.93 86.64,79.57 v97.01,79.57 128.37,79.57 129.37,80.56 129.83,80.56 | 129.83,80.56 | 129.83,80.56 v130.8,80.56 | v61.73,71.92 59.87,70.06 59.87,61.12 60.59,60.41 61.83,60.41 63.06,59.17 IC7.8
A5  (via drill 0.35)
  Top 0.152: v96.14,79.01 96.14,76.31 RN8.2 | IC10.48 63.56,70.76 63.56,76.72 64.14,77.29 IC1.35
  Top 0.254: CN2.31 128.33,94.11 128.33,88.17 129.6,86.9 v129.6,80.01 CN1.31
  Bottom 0.152: v129.6,80.01 128.6,79.01 v96.14,79.01 86.73,79.01 82.14,83.6 67.85,83.6 IC1.35 64.14,78.72 58.32,72.9 58.32,61.21 60.19,59.34 61.13,59.34 IC7.7
A6  (via drill 0.35)
  Top 0.152: v95.37,78.45 95.43,78.4 RN8.3 | IC1.36 67.52,79.32 67.52,72.59 IC10.45
  Top 0.254: CN1.22 143.49,71.03 v143.49,79.81 143.49,87.06 142.3,88.25 CN2.22
  Bottom 0.152: v143.49,79.81 143.46,79.78 140.91,79.78 139.59,78.45 v95.37,78.45 86.82,78.45 82.01,83.27 70.06,83.27 IC1.36 67.51,79.19 67.51,71.82 62.01,66.32 62.01,63.54 IC7.6
A7  (via drill 0.35)
  Top 0.152: IC10.43 55.64,59.3 55.64,59.54 69.22,73.11 IC1.37 | RN8.4 94.63,77.83 v94.57,77.89
  Top 0.254: CN2.21 141,94.08 141,88.33 142.3,87.03 v142.3,79.23 CN1.21
  Bottom 0.152: v142.3,79.23 142.26,79.18 140.78,79.18 139.48,77.89 v94.57,77.89 86.92,77.89 81.87,82.94 72.27,82.94 IC1.37 69.22,68.73 65.05,64.56 65.05,61.23 64.28,60.45 62.56,60.45 IC7.5
A8  (via drill 0.35)
  Top 0.152: IC10.40 56.62,58.15 56.62,59.58 71.75,74.72 IC1.38 | v85.45,77.33 v85.46,77.32 RN9.1
  Top 0.254: CN1.24 141.01,71.09 v141.01,78.63 141.01,86.96 139.76,88.21 CN2.24
  Bottom 0.152: v141.01,78.63 139.71,77.33 v85.45,77.33 80.76,82.02 73.89,82.02 IC1.38 71.75,70 75.48,66.28 75.48,60.64 IC7.27
A9  (via drill 0.35)
  Top 0.152: IC10.38 57.41,57.54 57.41,59.44 74.3,76.33 IC1.39 | v84.65,76.77 84.65,74.53 RN9.2
  Top 0.254: CN2.17 146.06,94.06 146.06,88.39 147.38,87.07 CN1.17
  Bottom 0.152: CN1.17 145.3,76.77 v84.65,76.77 79.73,81.69 75.85,81.69 74.44,80.28 IC1.39 74.3,79.91 74.3,73.08 78.59,68.79 78.59,57.21 76.41,55.03 72.75,55.03 IC7.26
A10  (via drill 0.35)
  Top 0.152: v83.86,76.21 RN9.3 | IC10.34 54.03,47.75 58.49,47.75 59.12,48.38 59.12,59.78 59.8,60.47 64.45,60.47 64.74,60.76 64.74,65.84 76.83,77.93 IC1.40
  Top 0.254: CN1.20 146.02,71.02 146.02,87.08 144.84,88.25 CN2.20
  Bottom 0.152: CN1.20 145.98,70.98 145.98,75.63 145.39,76.22 83.87,76.22 v83.86,76.21 80.03,80.03 IC1.40 76.83,71.31 79.59,68.56 79.59,56.47 76.77,53.65 74.13,53.65 IC7.23
A11  (via drill 0.35)
  Top 0.152: IC10.33 53.65,47.42 58.63,47.42 59.45,48.24 59.45,59.65 59.94,60.14 64.58,60.14 65.07,60.63 65.07,65.7 71.32,71.95 73.27,71.95 73.72,72.39 | RN9.4 82.47,74.52 v82.45,74.51 | 73.72,72.39 78.47,77.15 v78.47,77.25 78.47,81.66 76.83,83.3 IC1.1 | v74.1,72.02 74.09,72.02 73.72,72.39
  Top 0.254: CN2.19 143.53,94.08 143.53,88.25 144.84,86.94 CN1.19
  Bottom 0.152: v74.1,72.02 77.39,68.74 77.39,58.19 75.81,56.61 74.02,56.61 IC7.25 | v82.45,74.51 79.71,77.25 v78.47,77.25 | CN2.19 143.38,96.85 97.81,96.85 93.67,92.71 84.45,92.71 83.3,93.87 79.14,93.87 77.74,95.27 IC1.1
A12  (via drill 0.35)
  Top 0.152: v80.23,93.22 80.22,93.23 RN10.1 | IC10.35 54.41,48.09 58.35,48.09 58.79,48.52 58.79,59.92 59.67,60.8 62.49,60.8 62.71,61.02 62.71,63.12 IC7.4 64.41,64.82 64.41,65.97 75.61,77.18 75.61,82.47 74.3,83.79 IC1.2
  Top 0.254: CN1.23 139.76,86.95 138.33,88.39 138.33,93.95 CN2.23
  Bottom 0.152: CN2.23 138.56,94.18 102.38,94.18 | 102.38,94.18 101.44,93.25 95.42,93.24 94.45,92.27 83.98,92.27 83.03,93.22 v80.23,93.22 80.21,93.23 75.26,93.23 74.8,93.73 74.3,94.23 IC1.2 | 102.38,94.18
A13  (via drill 0.35)
  Top 0.152: IC10.39 57.01,57.84 57.01,59.51 73.12,75.62 v73.12,77.03 73.12,82.85 71.75,84.22 IC1.3 | RN10.2 81.02,92.63 v81.06,92.59
  Top 0.254: CN1.26 138.4,71.03 138.4,87.17 137.22,88.36 CN2.26
  Bottom 0.152: CN2.26 137.22,92.6 135.97,93.85 105.27,93.85 104.02,92.61 95.5,92.61 94.71,91.82 83.82,91.82 83.03,92.61 81.07,92.61 v81.06,92.59 v81.06,92.6 73.25,92.6 71.75,94.09 IC1.3 | IC7.28 72.39,58.01 75.08,58.01 76.32,59.25 76.32,68.15 73.12,71.34 v73.12,77.03
A14  (via drill 0.35)
  Top 0.152: IC10.41 56.15,58.4 56.15,59.58 70.61,74.04 70.61,83.39 69.22,84.79 IC1.4 | RN10.3 81.82,92.12 v81.9,92.04
  Top 0.254: CN2.25 135.96,94.13 v135.96,92.74 135.96,88.49 137.22,87.23 CN1.25
  Bottom 0.152: v135.96,92.74 135.18,93.52 105.4,93.52 103.85,91.97 95.46,91.97 94.98,91.49 83.69,91.49 83.21,91.97 81.98,91.97 v81.9,92.04 81.87,92.01 71.37,92.01 69.22,94.17 IC1.4
A15  (via drill 0.35)
  Top 0.152: IC10.44 68.1,72.47 68.1,83.93 66.67,85.36 IC1.5 | RN10.4 82.62,91.54 v82.76,91.4
  Top 0.254: CN1.18 148.52,70.98 148.52,87.08 147.31,88.28 147.31,91.06 147.38,91 CN2.18
  Bottom 0.152: CN2.18 145.72,88.88 137.13,88.88 135.97,90.03 135.97,91.61 134.39,93.19 105.55,93.19 103.75,91.4 95.48,91.4 95.25,91.16 83.31,91.16 83.07,91.4 v82.76,91.4 82.75,91.38 69.57,91.38 66.67,94.28 IC1.5
AD0  (via drill 0.35)
  Top 0.152: IC9.49 134.42,37.29 131.81,37.29 127.87,33.35 IC3.14 v127.87,30.37 127.87,29.73 126.69,28.56 126.69,22.9 127.86,21.73 IC2.14 | IC5.14 153.61,30 152.35,28.74 152.35,23.11 153.61,21.84 IC4.14
  Top 0.2: IC2.14
  Bottom 0.152: v127.87,30.37 127.97,30.48 153.03,30.48 153.61,31.07 IC5.14
AD1  (via drill 0.35)
  Top 0.152: IC2.13 130.41,21.68 129.17,22.91 129.17,28.68 v130.4,29.91 v130.41,29.92 IC3.13 130.41,34.22 132.92,36.73 135.64,36.73 IC9.50 | IC5.13 156.15,29.96 154.9,28.71 154.9,23.31 156.15,22.06 IC4.13
  Bottom 0.152: v130.4,29.91 130.5,30.01 155.35,30.01 156.15,30.81 IC5.13
AD2  (via drill 0.35)
  Top 0.152: IC4.12 158.69,22.04 157.47,23.27 157.47,28.74 158.69,29.97 IC5.12 | IC2.12 132.95,22 131.93,23.02 131.93,28.82 v132.51,29.39 132.95,29.83 IC3.12 132.95,33.15 135.19,35.39 136.07,35.39 IC9.51
  Bottom 0.152: v132.51,29.39 132.61,29.49 157.66,29.49 158.69,30.53 IC5.12
AD3  (via drill 0.35)
  Top 0.152: IC9.52 141.39,37.76 141.19,37.56 139.84,37.56 135.49,33.2 IC3.11 135.49,30.01 134.22,28.75 v134.19,28.75 134.19,23.1 135.49,21.8 IC2.11 | IC4.11 161.23,21.98 159.97,23.25 159.97,28.73 161.23,30 IC5.11
  Bottom 0.152: v134.19,28.75 134.34,28.9 160.07,28.9 161.23,30.07 IC5.11
AD4  (via drill 0.35)
  Top 0.152: IC5.8 161.23,23.44 162.5,22.17 162.5,16.59 161.23,15.32 IC4.8 | IC9.53 143.17,38.64 141.01,36.48 139.82,36.48 136.8,33.46 136.8,30.02 135.49,28.7 IC3.8 135.49,22.94 136.76,21.66 136.76,18.11 136.74,18.08 | IC2.8 135.49,16.83 136.74,18.08 | 136.74,18.08 v136.76,18.08
  Bottom 0.152: IC4.8 161.23,17.07 160.22,18.08 v136.76,18.08
AD5  (via drill 0.35)
  Top 0.152: IC9.54 144.95,39.5 144.42,40.02 141.03,40.02 140.52,39.51 140.52,38.4 140.13,38.01 139.51,38.01 136.56,35.05 135.91,35.05 134.17,33.32 134.17,29.88 132.95,28.66 IC3.7 132.95,23.05 134.18,21.82 v134.18,17.49 | IC5.7 158.69,23.26 159.95,22.01 159.95,16.56 158.69,15.31 IC4.7 | IC2.7 132.95,16.26 v134.18,17.49 | v134.18,17.49
  Bottom 0.152: IC4.7 158.69,15.82 157.02,17.49 v134.18,17.49
AD6  (via drill 0.35)
  Top 0.152: IC9.55 145.04,40.61 139.17,40.61 138.7,40.15 138.7,38.63 135.95,35.88 133.94,35.88 131.65,33.59 131.65,29.82 130.41,28.57 IC3.6 130.41,23.02 131.64,21.79 131.64,16.93 | IC5.6 156.15,23.33 157.42,22.07 157.42,16.67 156.15,15.41 IC4.6 | IC2.6 130.41,15.7 131.64,16.93 | 131.64,16.93 v131.66,16.93
  Bottom 0.152: IC4.6 156.15,15.65 154.87,16.93 v131.66,16.93
AD7  (via drill 0.35)
  Top 0.152: IC4.10 163.77,22.14 162.56,23.35 162.56,28.72 163.77,29.93 IC5.10 | IC9.56 147.43,37.85 143.32,37.85 141.31,35.84 140.14,35.84 138.03,33.72 IC3.10 139.18,31.37 v139.18,28.22 139.18,23.43 138.03,22.27 IC2.10
  Bottom 0.152: v139.18,28.22 139.21,28.25 162.06,28.25 163.77,29.96 IC5.10
ARM_SND  (via drill 0.35)
  Top 0.152: IC11.20 33.33,17.28 33.91,16.7 v40.2,16.7
  Top 0.254: C58.1 54.25,17.37 v53.23,16.34
  Bottom 0.152: v40.2,16.7 40.81,17.3 41.96,17.3 42.93,16.33 53.21,16.33 v53.23,16.34
ARMD0
  Top 0.152: IC10.136 27.73,32.8 27.73,21.14 29.78,19.09 29.78,16.51 31.42,14.86 32.34,14.86 IC11.25
ARMD1
  Top 0.152: IC11.26 30.58,14.28 29.45,15.42 29.45,18.95 27.36,21.04 27.36,33.14 IC10.135
ARMD2
  Top 0.152: IC11.27 30.61,13.78 29.12,15.28 29.12,18.81 27.03,20.91 27.03,33.51 IC10.134
ARMD3  (via drill 0.35)
  Top 0.152: v41.65,13.07 42.85,14.28 IC11.55 | IC10.133 26.7,33.89 26.7,20.66 28.25,19.1 v28.25,16.62
  Bottom 0.152: v28.25,16.62 28.37,16.62 32.2,12.79 39.53,12.79 39.82,13.07 v41.65,13.07
ARMD4  (via drill 0.35)
  Top 0.152: IC11.56 42.48,14.78 v41.64,13.96 | IC10.132 26.36,34.27 26.36,20.52 27.63,19.26 v27.63,17.26
  Bottom 0.152: v27.63,17.26 29.2,17.26 33.34,13.12 39.39,13.12 40.23,13.96 v41.64,13.96
ARMD5  (via drill 0.35)
  Top 0.152: IC11.57 42.37,15.28 41.91,14.82 v41.64,14.82 | IC10.131 26.04,34.64 26.04,20.32 27.05,19.31 27.05,17.9 v27.02,17.87
  Bottom 0.152: v27.02,17.87 29.06,17.87 29.71,17.22 33.48,13.45 39.25,13.45 40.63,14.82 v41.64,14.82
ARMD6  (via drill 0.35)
  Top 0.152: IC11.58 41.81,15.78 v41.67,15.68 | IC10.130 25.7,35.02 25.7,20.19 26.39,19.5 v26.39,18.47
  Bottom 0.152: v26.39,18.47 28.94,18.47 33.64,13.78 39.12,13.78 41.02,15.68 v41.67,15.68
ARMD7  (via drill 0.35)
  Top 0.152: IC11.59 42.7,16.28 42.44,16.54 v41.68,16.54 | v25.79,19.11 25.38,19.53 25.38,35.4 IC10.129
  Bottom 0.152: v25.79,19.11 28.8,19.11 33.79,14.11 38.98,14.11 41.41,16.54 v41.68,16.54
ARMINT  (via drill 0.35)
  Top 0.152: IC10.82 34.32,62.52 33.38,62.52 33.06,62.2 26.08,62.2 v24.23,64.05 | IC11.8 38.34,22.64 36.45,24.54 33.32,24.54 32.35,25.5 32.35,28.52 v32.07,28.8
  Bottom 0.152: v24.23,64.05 24.46,63.81 24.46,52.5 23.49,51.53 23.49,45.9 31.69,37.69 31.69,29.18 v32.07,28.8
AUD_O
  Top 0.254: U$3.P$6 108.48,19.02 97.93,19.02 | C61.2 94.48,18.02 U$3.P$7 97.48,19.02 97.93,19.02 | AUD.1 97.98,19.07 97.93,19.02
AUX_MIXED  (via drill 0.35)
  Top 0.152: 96.15,61.46 R1.1 | 92.69,83.44 92.69,83.39
  Top 0.254: 85.14,26.6 81.4,26.6 80.46,25.66 R10.2 78.14,24.44 C60.1 76.64,25.9 68.28,25.9 | IC12.6 83.85,22.97 84.28,23.39 C44.1 84.28,25.73 85.14,26.6 | R1.1 96.24,59.33 99.4,56.16 104.72,56.16 106.96,53.92 106.96,43.3 93.23,29.57 93.23,27.28 92.55,26.6 87.92,26.6 | R8.1 94.75,86.93 92.69,84.86 92.69,83.44 | 92.69,83.39 92.69,63.27 94.5,61.46 96.15,61.46 | 85.14,26.6 87.92,26.6 | R16.1 59.28,20.91 R9.1 59.28,23.25 v60.97,24.93 | R22.1 87.91,26.59 87.92,26.6
  Top 0.305: 68.28,25.9 64.98,25.9 v64.02,24.94
  Bottom 0.152: v64.02,24.93 v64.02,24.94
  Bottom 0.254: v60.97,24.93 v64.02,24.93
AVCC_PIN21
  Bottom 0.406: IC9.21 127.17,56.59 121.47,50.9 JP4.1
B_O  (via drill 0.35)
  Top 0.254: IC9.24 126.16,53.65 v150.35,53.65
  Bottom 0.254: v150.35,53.65 156.27,53.65 166.01,43.92 166.01,12.12 164.46,10.57 117.12,10.57 115.75,11.95 115.75,13.88 114.96,14.67 VIDEO.6 114.32,14.62 111.5,14.62 110.99,15.13 109.97,15.13 108.27,16.84 106.83,16.84 105.13,15.13 98.58,15.13 U$3.P$5
BDIR  (via drill 0.35)
  Top 0.152: v95.73,39.92 90.47,34.65 46.63,34.65 IC10.5
  Top 0.254: CN2.10 157.54,88.34 158.77,87.11 158.77,71.07 CN1.10 149.39,61.69 149.39,55.88 v149.37,55.86
  Bottom 0.152: v149.37,55.86 138.47,44.95 98.64,44.95 98.29,44.61 98.29,42.48 v95.73,39.92
BOOT  (via drill 0.35)
  Top 0.152: IC11.60 44.69,16.78 45.07,16.4 45.07,14.71 46.23,13.56 52.5,13.56 53.54,14.6 57.53,14.6 61.07,11.06 61.07,10.29 v61.99,9.37
  Bottom 0.152: v61.99,9.37 62.92,8.43 62.92,5.66 61.48,4.21 BOOT0.2
BTN3
  Top 0.152: IC11.50 44.58,11.78 45.4,10.95 51.64,10.95 53.07,12.39 JAM.1
BTN4
  Top 0.152: IC11.43 39.34,10.31 39.75,10.73 43,10.73 45.11,8.61 48.73,8.61 49.95,9.84 JAM.2
BUSAK
  Top 0.152: IC1.23 33.66,72.76 33.71,72.7 33.71,66.66 IC10.77
BUSRQ
  Top 0.152: IC10.71 41.85,65.31 41.85,70.65 38.73,73.77 IC1.25
CAS0
  Top 0.152: IC3.16 122.79,29.78 121.48,28.47 121.48,22.97 122.79,21.66 IC2.16
  Bottom 0.152: IC3.16 122.79,33.93 124.26,35.41 151.61,35.41 151.61,35.4 153.86,35.4 IC9.61
CAS1
  Top 0.152: IC4.16 147.55,21.76 147.55,31.54 IC5.16 148.53,34.73 150.88,37.08 153.76,37.08 IC9.60
CLK28M  (via drill 0.35)
  Top 0.254: v29.68,67.54 29.65,67.56 23.55,67.56 23.32,67.33 OSC2.3 | IC10.30 38.09,60.87 v38.09,61.21
  Bottom 0.254: v38.09,61.21 38.05,61.21 31.73,67.54 v29.68,67.54
CLKCPU
  Top 0.254: IC1.6 64.14,85.63 65.5,84.41 65.5,77.5 66.42,76.57 IC14.4
CLKCPU_RAW
  Top 0.254: IC10.46 65.47,71.26 IC14.2
D0  (via drill 0.35)
  Top 0.152: IC10.64 46.51,65.02 46.51,73.86 45.19,75.18 45.19,88.53 43.81,89.9 IC1.14 | IC9.40 120.06,56.1 120.94,56.98 120.94,63.72 CN1.34 | RN4.1 v90.9,87.31 v90.91,87.31
  Top 0.254: CN1.34 128.27,71.05 128.27,87.07 127.06,88.28 CN2.34
  Bottom 0.152: CN2.34 127.06,89.37 124.43,86.74 117.55,86.74 116.98,87.31 v90.91,87.31 85.56,87.31 84.31,88.55 50.53,88.55 43.83,95.25 IC1.14 | IC9.40 116.61,35.48 69.43,35.48 IC13.37 61.48,51.06 IC7.13
D1  (via drill 0.35)
  Top 0.152: CN1.33 127.06,71.63 125.97,70.54 125.97,69.72 119.6,63.35 119.6,59.28 119.13,58.81 119.13,39.78 IC9.39 | IC10.68 44.14,65.48 44.14,73.03 42.69,74.48 42.69,89.03 41.27,90.44 IC1.15 | v91.69,86.73 91.7,86.75 RN4.2
  Top 0.254: CN2.33 125.84,94.17 125.84,88.53 v126.7,87.67 127.06,87.31 CN1.33
  Bottom 0.152: v126.7,87.67 125.45,86.41 117.41,86.41 117.09,86.73 v91.69,86.73 85.67,86.73 84.17,88.22 45.84,88.22 41.25,92.81 41.25,95.24 IC1.15 | IC9.39 115.16,35.81 71.64,35.81 IC13.36 64.02,48.52 IC7.14
D2  (via drill 0.35)
  Top 0.152: CN1.36 118.57,63.9 118.57,60.01 117.46,58.9 117.46,56.97 116.5,56.01 IC9.38 | IC1.12 48.9,95.13 48.9,88.8 50.28,87.41 50.28,65.26 IC10.59 | RN4.3 92.5,88.58 v92.51,88.57
  Top 0.254: CN1.36 125.68,71 125.68,87.39 v124.98,88.08 124.52,88.55 CN2.36
  Bottom 0.152: IC9.38 113.71,36.14 73.85,36.14 IC13.35 65.34,44.65 65.34,49.74 IC7.15 | v124.98,88.08 123.97,87.07 119.09,87.07 117.59,88.57 97.21,88.57 v92.51,88.57 85.22,88.57 84.58,89.21 55.09,89.21 IC1.12
D3  (via drill 0.35)
  Top 0.152: 124.52,74.82 124.52,71.84 123.31,70.63 123.31,69.47 117.98,64.14 117.98,60.95 116.86,59.83 116.24,59.83 115.54,59.13 115.54,56.98 114.72,56.16 IC9.37 | IC10.51 60.29,69.61 60.29,85.54 59.05,86.78 IC1.8 | v93.31,90.26 v93.3,90.26 RN4.4
  Top 0.254: CN2.35 123.25,94.12 v123.25,89.22 123.25,88.63 124.52,87.36 124.52,74.82 CN1.35
  Bottom 0.152: v123.25,89.22 121.37,89.22 120.88,89.71 120.88,91.55 119.9,92.53 105.82,92.53 103.55,90.26 v93.31,90.26 62.94,90.26 59.05,94.14 IC1.8 | IC9.37 112.26,36.47 76.06,36.47 IC13.34 67.65,44.88 67.65,49.97 IC7.17
D4  (via drill 0.35)
  Top 0.152: IC10.49 62.93,70.83 62.93,84.91 61.59,86.24 IC1.7 | IC9.36 112.11,39.77 112.11,55.17 113.81,56.88 113.81,59.34 114.81,60.35 114.81,64.05 116.82,66.05 118.59,66.05 121.98,69.44 CN1.38 | RN6.1 v95.82,90.84 v95.81,90.83
  Top 0.254: CN1.38 123.16,71.02 123.16,87.32 121.98,88.5 CN2.38
  Bottom 0.152: CN2.38 121.98,91.9 121.02,92.86 105.68,92.86 103.65,90.83 v95.81,90.83 64.92,90.83 61.59,94.15 IC1.7 | IC9.36 110.82,36.8 78.27,36.8 IC13.33 68.92,46.15 IC7.18
D5  (via drill 0.35)
  Top 0.152: CN1.37 121.98,71.5 120.66,70.17 120.66,69.29 118.01,66.64 115.76,66.64 112.07,62.95 112.07,56.87 111.16,55.97 IC9.35 | IC10.53 57.84,68.57 57.84,85.9 56.52,87.22 IC1.9 | RN6.2 96.62,89.72 v96.64,89.7
  Top 0.254: CN2.37 120.64,94.05 v120.64,88.66 121.98,87.33 CN1.37
  Bottom 0.152: IC1.9 56.52,95.25 56.52,94.24 60.89,89.87 84.86,89.87 85.03,89.7 v96.64,89.7 103.45,89.7 105.96,92.2 119.77,92.2 120.55,91.42 120.55,88.75 v120.64,88.66 | IC9.35 109.37,37.13 80.48,37.13 IC13.32 70.19,47.42 70.19,49.97 IC7.19
D6  (via drill 0.35)
  Top 0.152: CN1.40 116.63,67.03 115.53,67.03 110.31,61.81 110.31,57.11 109.39,56.19 IC9.34 | IC10.56 55.37,68.22 55.37,86.38 53.98,87.78 IC1.10 | RN6.3 97.42,89.15 v97.44,89.13
  Top 0.254: CN1.40 120.64,71.04 120.64,87.19 119.4,88.43 119.4,90.5 CN2.40
  Bottom 0.152: IC9.34 107.92,37.46 82.69,37.46 IC13.31 76.72,46.63 74.34,49.01 IC7.20 | v97.44,89.13 | CN2.40 118.1,91.87 106.09,91.87 103.35,89.13 v97.44,89.13 | v97.44,89.13 96.52,89.13 96.51,89.13 85.13,89.13 84.72,89.54 58.71,89.54 53.98,94.28 IC1.10
D7  (via drill 0.35)
  Top 0.152: IC10.60 48.99,64.67 48.99,74.62 47.72,75.89 47.72,87.92 46.35,89.28 IC1.13 | IC9.32 107.61,59.77 115.39,67.55 116.35,67.55 118.14,69.34 118.14,70.5 119.44,71.8 CN1.39 | CN2.39 118.01,96.82 105.82,96.82 102.37,93.37 RN6.4
  Top 0.254: CN2.39 118.08,94.03 v118.08,87.3 119.44,85.94 CN1.39
  Bottom 0.152: v118.08,87.3 117.51,87.87 85.45,87.87 84.44,88.88 52.88,88.88 IC1.13 | IC9.32 89.19,57.98 82.76,51.55 IC7.21 79.26,46.3 IC13.30
G_O  (via drill 0.35)
  Top 0.254: IC9.22 125.39,57.13 127.46,55.05 v151.95,55.05 | VIDEO.5 114.33,12.13 111.21,9.01 105.52,9.01 102.98,11.55 U$3.P$2
  Bottom 0.254: v151.95,55.05 157.18,55.05 169.51,42.72 169.51,13.47 163.02,6.97 120.25,6.97 119.09,5.81 109.2,5.81 U$3.P$2
GND  (via drill 0.3 pad 0.76, 0.35, 3.17 pad 5.33)
  Top 0.152: IC10.72 40.57,65.44 v40.57,65.56 | IC10.144 | IC10.36 53.65,50.26 v53.69,50.26 | IC10.47 48.91,55.4 v48.88,55.4 | IC10.62 43.56,60.66 v43.53,60.66 | IC10.89 33.2,58.69 v33.2,58.35 32.83,58.35 IC10.90 | IC10.99 29.81,55.01 v29.85,55.01 | IC10.108 26.36,52.09 v27.67,52.09 | IC10.123 31.58,45.85 v31.63,45.85 | IC10.114 28.39,49.02 v28.44,49.02 | IC10.18 46.04,44.43 v46.01,44.43 | IC10.29 50.02,48.23 v49.45,48.23 | IC6.34 v10.1,50.02 | IC6.12 9.3,59.22 v9.26,59.18 | v170.48,28.52 C18.1 | C20.1 v125.52,9.48 v125.51,9.48 | C21.1 142.76,35.94 v142.75,35.96 | C27.1 v114.33,16.34 | PWR.C v25.09,1.34 | C3.2 23.24,1.65 v23.2,1.61 | C15.1 95.02,84.47 v95,84.48 | C6.2 21.8,44.52 v21.15,45.18 | v45.19,17.71 44.62,18.28 IC11.63 | v102.77,49.31 v102.78,49.32 C17.1 104.02,48.57 R7.1 | C2.2 v48.64,9.78 v48.65,9.79 | v36.85,19.44 36.54,19.44 36.34,19.64 IC11.12 | v29.53,8.82 C22.2 29.69,9.99 30.4,9.99 30.72,10.31 30.72,11.37 31.14,11.78 IC11.31 | IC11.47 41.34,8.25 v41.43,8.16 | v57.27,56.02 56.64,55.4 C28.2 | C31.2 39.56,70.31 v39.52,70.36 | C33.2 6.77,62.38 v5.81,62.38 | C29.2 32.53,63.51 v31.96,62.94 | C37.1 167.34,54.99 v167.07,55.93 | v27,87.3 C39.1 | C10.2 v49.52,18.62 C11.2 | IC11.18 33.38,18.28 v33.65,18.55 | C24.2 v22.95,36.42 | C47.2 52.83,74.59 v52.83,76.25 | IC15.15 v68.51,21.89 v68.5,21.89 | IC15.8 v65.16,14.27 | IC16.8 45.1,23.91 v45.11,23.93 | v48.41,31.16 48.78,31.53 IC16.15 IC16.14 | C49.1 112.99,61.41 v112.99,60.27 | C48.1 139.4,61.96 v139.44,62.01 | IC17.7 34.52,23.91 v35.86,23.91 | v48.17,21.38 49.33,21.38 C50.1 | v98.59,68.45 97.28,68.45 C38.1 | C56.1 v57.11,53.49 | v53.8,25.25 53.81,25.25 C57.1 | IC16.11 IC16.10 48.38,25.18 v48.37,25.19
  Top 0.152: IC16.13 48.37,28.99 v48.36,29.01 | S1.2 39.59,4.8 v39.57,4.79 | S2.1 51.44,2.28 v51.42,2.3 | S2.2 51.44,4.82 v51.39,4.87
  Top 0.203: C23.1 159.69,61.7 v159.68,61.71
  Top 0.254: C13.2 25.05,39.33 24.19,38.47 v24.19,38.43 | v120,1.79 119.97,1.82 C25.2 | C40.1 114.05,34.87 v114.07,34.86 | R12.1 100.59,23.16 v100.59,24.22 | v66.17,73.94 66.42,73.69 IC14.3 | v38.58,37.06 IC10.144 | OSC2.2 | v23.32,71.39 OSC2.2 | C52.2 167.25,49.78 v167.32,49.78 | C53.1 v142.82,9.34 | C54.1 v157.97,35.92 | IC12.4 85.12,17.27 v85.11,17.28 | C62.2 v89.27,25.15 | v64.21,11.44 v64.22,11.44 C7.2 | C55.1 110.36,29.64 v111.54,29.64 | C26.1 114.33,29.97 v114.33,31.11 | C45.2 110.46,23.68 v110.46,24.98 | v168.29,19.37 C19.1
  Top 0.305: CN1.46 CN1.44 | CN1.43 CN1.41 | CN2.46 CN2.44 | CN2.43 CN2.41 | C35.1 108.67,33.44 v109.91,33.44 | C36.2 11.75,47.11 v12.6,47.11 12.5,47.21 IC6.37 | C51.2 v170.12,32.05 v170.12,32.04 | C12.2 37.7,34.47 v37.61,34.56 | R4.1 v75.93,24.3 v75.93,24.31
  Top 0.406: v18.87,42.45 IC8.1 | v58.91,19.23 58.93,19.21 R14.2 | S1.1 v39.57,2.26 v39.56,2.26 | C1.2 20.12,35.03 v20.15,35.06 | C46.2 87.72,50.33 v87.74,50.36
  Bottom 0.152: v45.19,17.71 43.89,17.71 C4.2 | v38.99,15.08 C16.2 | C9.2 33.33,18.88 v33.65,18.55 | C14.2 36.94,19.52 v36.85,19.44 | C5.2 41.43,8.62 v41.43,8.16 | C30.2 49.33,55.4 v48.88,55.4 | C8.2 30.97,45.19 v31.63,45.85 | C32.2 27.75,52.17 v27.67,52.09 | C34.2 45.97,44.43 v46.01,44.43
  other vias: 172.11,2.91 172.11,82.55 86.87,68.21 19.05,95.91 19.05,2.91 172.11,46.99 86.87,95.76 90.42,18.03
  pour GND: 0,99.07 0,0 175.26,0 175.26,99.07
HALT
  Top 0.152: IC10.76 34.38,66.7 34.38,77.64 35.05,78.31 35.05,90.48 33.66,91.88 IC1.18
INTSIG4
  Top 0.152: IC10.140 29.05,31.3 29.05,21.68 31.12,19.61 31.12,17.04 31.37,16.78 IC11.21
INTSIG5